# EAGLE design fusebox (EAGLE 9.5.2)

## Sheet 1 of 6: MC
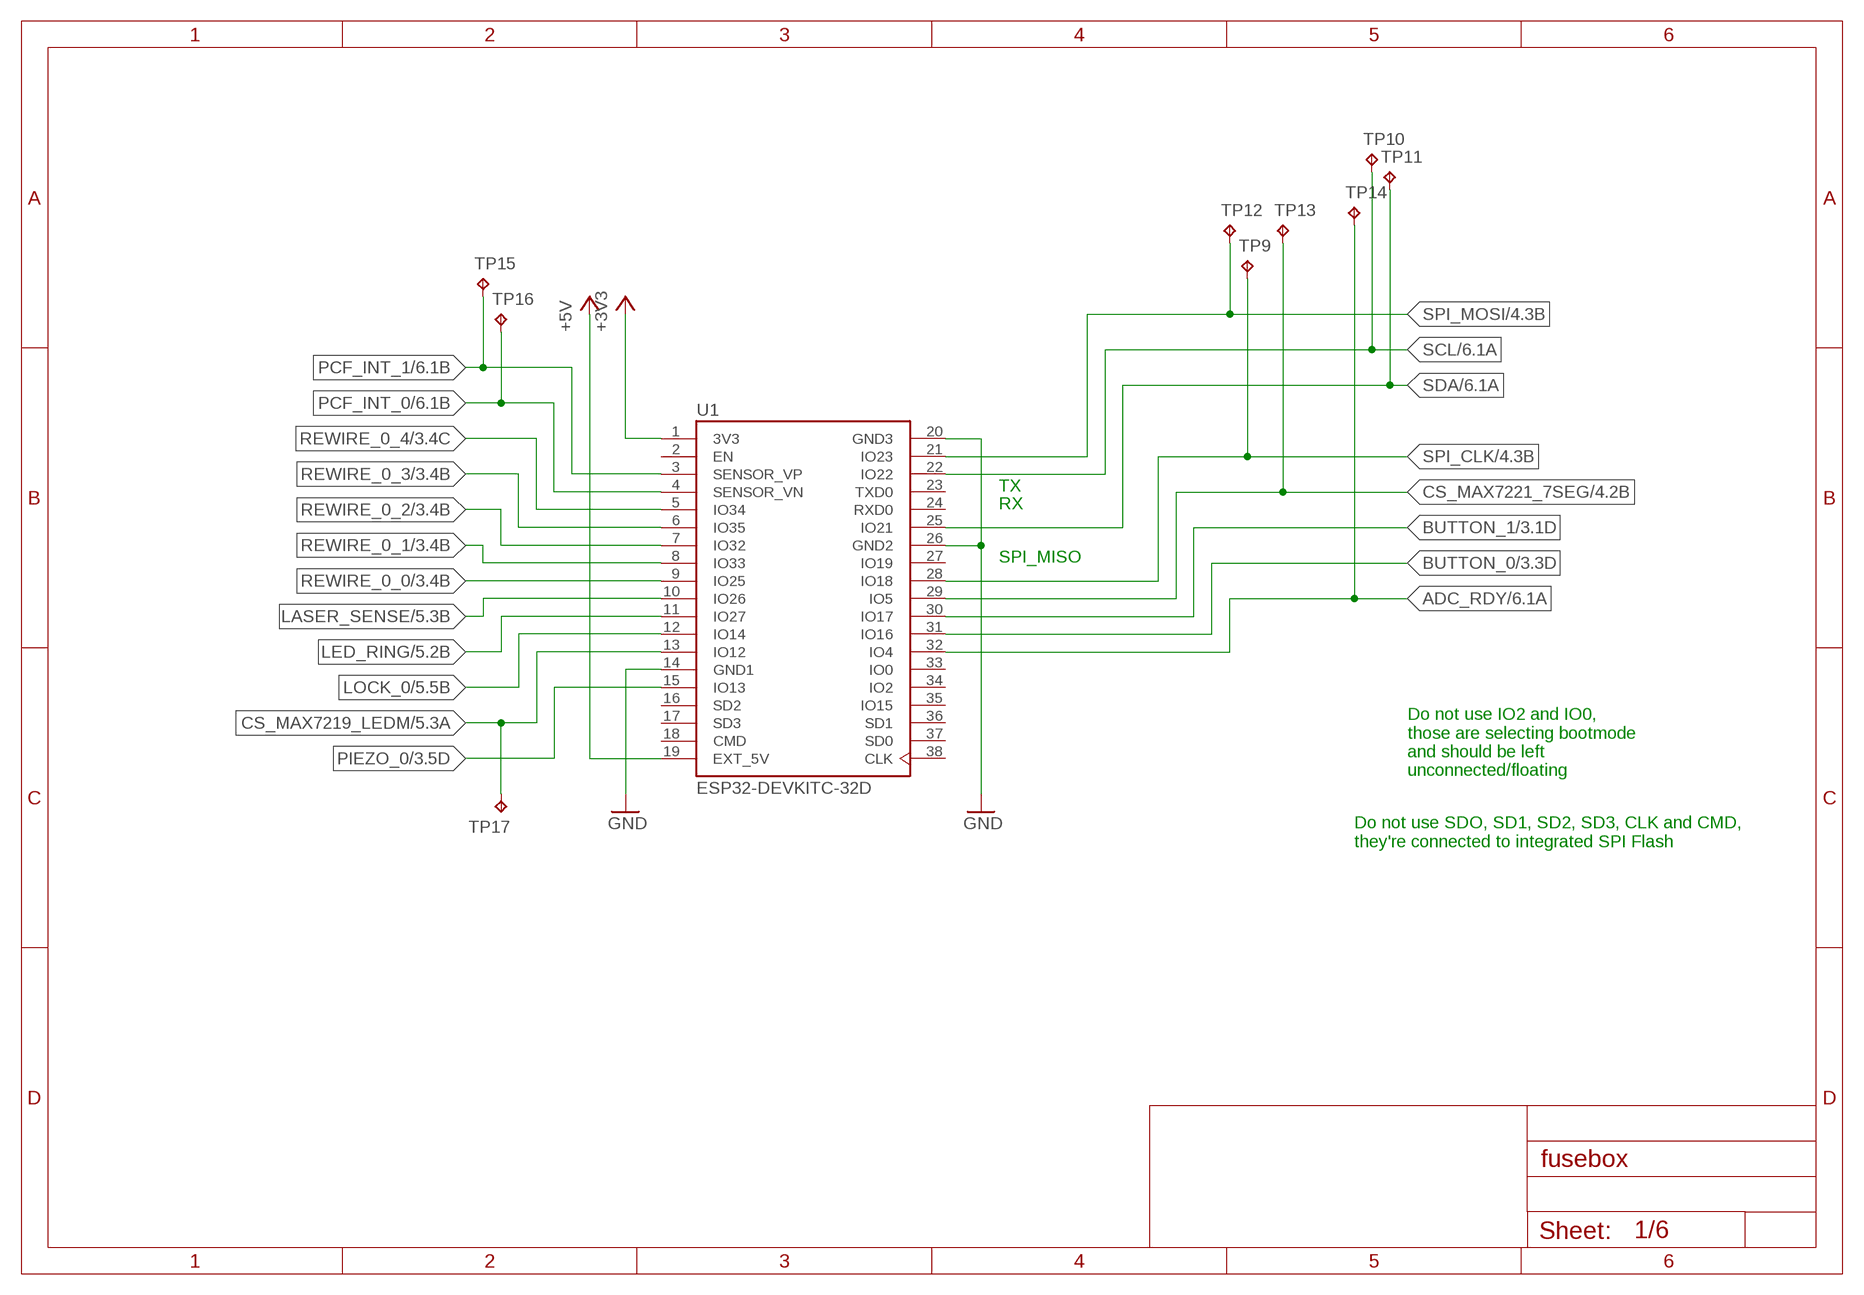
[diagram p0: schematic, sheet 1]

### Parts
TP9  TPB1,27  [B1,27]
TP10  TPB1,27  [B1,27]
TP11  TPB1,27  [B1,27]
TP12  TPB1,27  [B1,27]
TP13  TPB1,27  [B1,27]
TP14  TPB1,27  [B1,27]
TP15  TPB1,27  [B1,27]
TP16  TPB1,27  [B1,27]
TP17  TPB1,27  [B1,27]
U1  ESP32-DEVKITC-32D  [MODULE_ESP32-DEVKITC-32D]

### Nets
+3V3: U1.1(3V3) ; also sheet 3,5,6
+5V: U1.19(EXT_5V) ; also sheet 2,4,5
ADC_RDY: TP14.TP U1.32(IO4) ; also sheet 6
BUTTON_0: U1.31(IO16) ; also sheet 3
BUTTON_1: U1.30(IO17) ; also sheet 3
CS_MAX7219_LEDM: TP17.TP U1.13(IO12) ; also sheet 5
CS_MAX7221_7SEG: TP13.TP U1.29(IO5) ; also sheet 4
GND: U1.14(GND1) U1.20(GND3) U1.26(GND2) ; also sheet 2,3,4,5,6
LASER_SENSE: U1.10(IO26) ; also sheet 5
LED_RING: U1.11(IO27) ; also sheet 5
LOCK_0: U1.12(IO14) ; also sheet 5
PCF_INT_0: TP16.TP U1.4(SENSOR_VN) ; also sheet 6
PCF_INT_1: TP15.TP U1.3(SENSOR_VP) ; also sheet 6
PIEZO_0: U1.15(IO13) ; also sheet 3
REWIRE_0_0: U1.9(IO25) ; also sheet 3
REWIRE_0_1: U1.8(IO33) ; also sheet 3
REWIRE_0_2: U1.7(IO32) ; also sheet 3
REWIRE_0_3: U1.6(IO35) ; also sheet 3
REWIRE_0_4: U1.5(IO34) ; also sheet 3
SCL: TP10.TP U1.22(IO22) ; also sheet 6
SDA: TP11.TP U1.25(IO21) ; also sheet 6
SPI_CLK: TP9.TP U1.28(IO18) ; also sheet 4,5
SPI_MOSI: TP12.TP U1.21(IO23) ; also sheet 4,5
Unconnected: U1.2(EN) U1.16(SD2) U1.17(SD3) U1.18(CMD) U1.23(TXD0) U1.24(RXD0) U1.27(IO19) U1.33(IO0) U1.34(IO2) U1.35(IO15) U1.36(SD1) U1.37(SD0) U1.38(CLK)

### Notes on the sheet
- TX
- RX
- SPI_MISO
- Do not use IO2 and IO0, 
  those are selecting bootmode 
  and should be left 
  unconnected/floating
- Do not use SDO, SD1, SD2, SD3, CLK and CMD,
  they're connected to integrated SPI Flash

## Sheet 2 of 6: Power
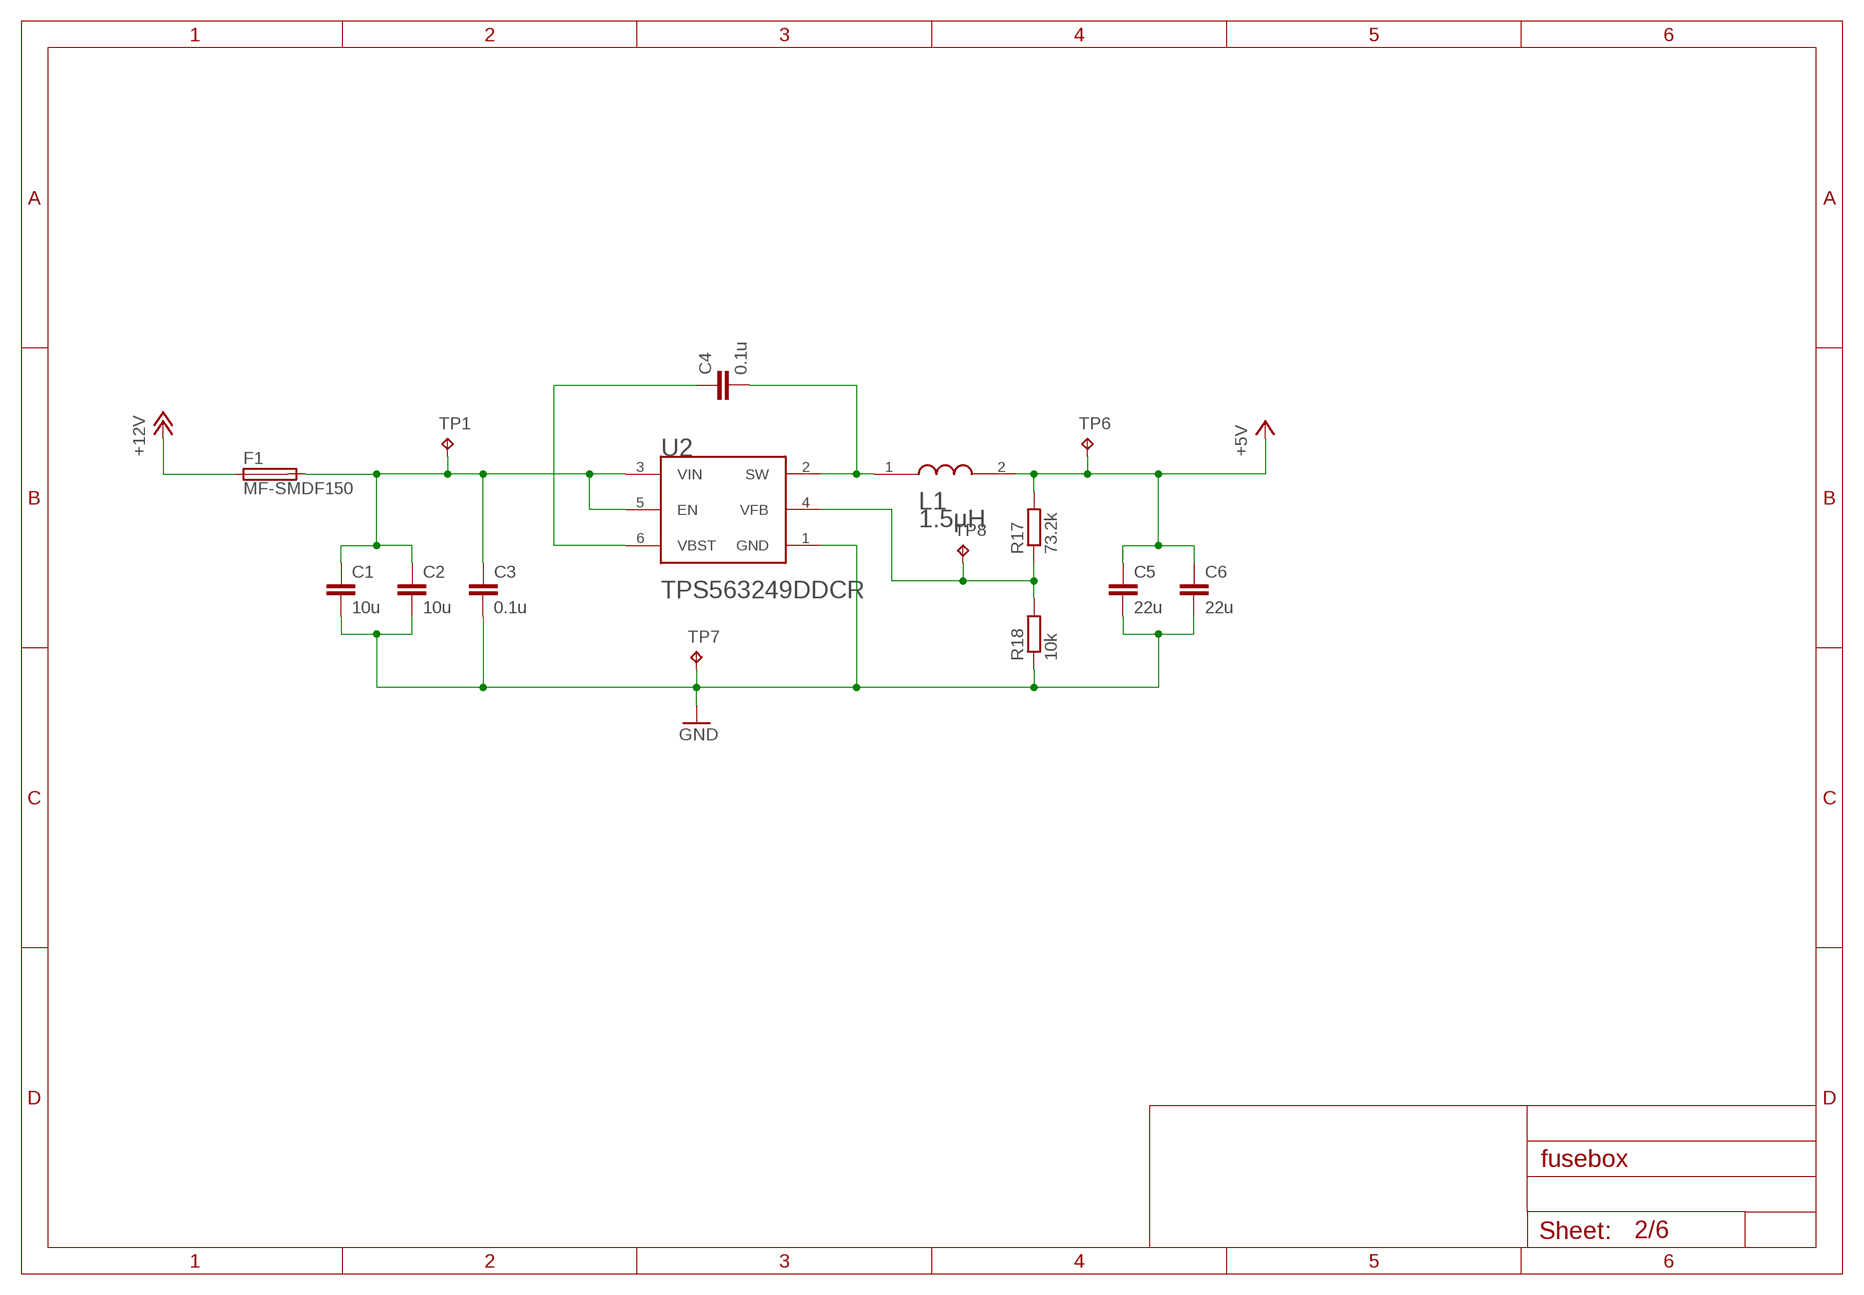
[diagram p1: schematic, sheet 2]

### Parts
C1  10u  C-EUC1206  [C1206]
C2  10u  C-EUC1206  [C1206]
C3  0.1u  C-EUC0603K  [C0603K]
C4  0.1u  C-EUC0603  [C0603]
C5  22u  C-EUC0603  [C0603]
C6  22u  C-EUC0603  [C0603]
F1  MF-SMDF150  [MF-SMDF050]
L1  BOURNS_SRN8040-1R5YBOURNS_SRN8040-1R5Y_0_0  [BOURNS_SRN8040-1R5Y_0]
R17  73.2k  R-EU_R0402  [R0402]
R18  10k  R-EU_R0201  [R0201]
TP1  TPB1,27  [B1,27]
TP6  TPB1,27  [B1,27]
TP7  TPB1,27  [B1,27]
TP8  TPB1,27  [B1,27]
U2  TEXAS_INSTRUMENTS_TPS563249DDCRTEXAS_INSTRUMENTS_TPS563249DDCR_0_0  [TEXAS_INSTRUMENTS_TPS563249DDCR_0]

### Nets
+5V: C5.1 C6.1 L1.2 R17.2 TP6.TP ; also sheet 1,4,5
+12V: F1.1 ; also sheet 5
GND: C1.2 C2.2 C3.2 C5.2 C6.2 R18.1 TP7.TP U2.1(GND) ; also sheet 1,3,4,5,6
N$18: C1.1 C2.1 C3.1 F1.2 TP1.TP U2.3(VIN) U2.5(EN)
N$36: C4.1 U2.6(VBST)
N$37: C4.2 L1.1 U2.2(SW)
N$39: R17.1 R18.2 TP8.TP U2.4(VFB)

## Sheet 3 of 6: Mechanical
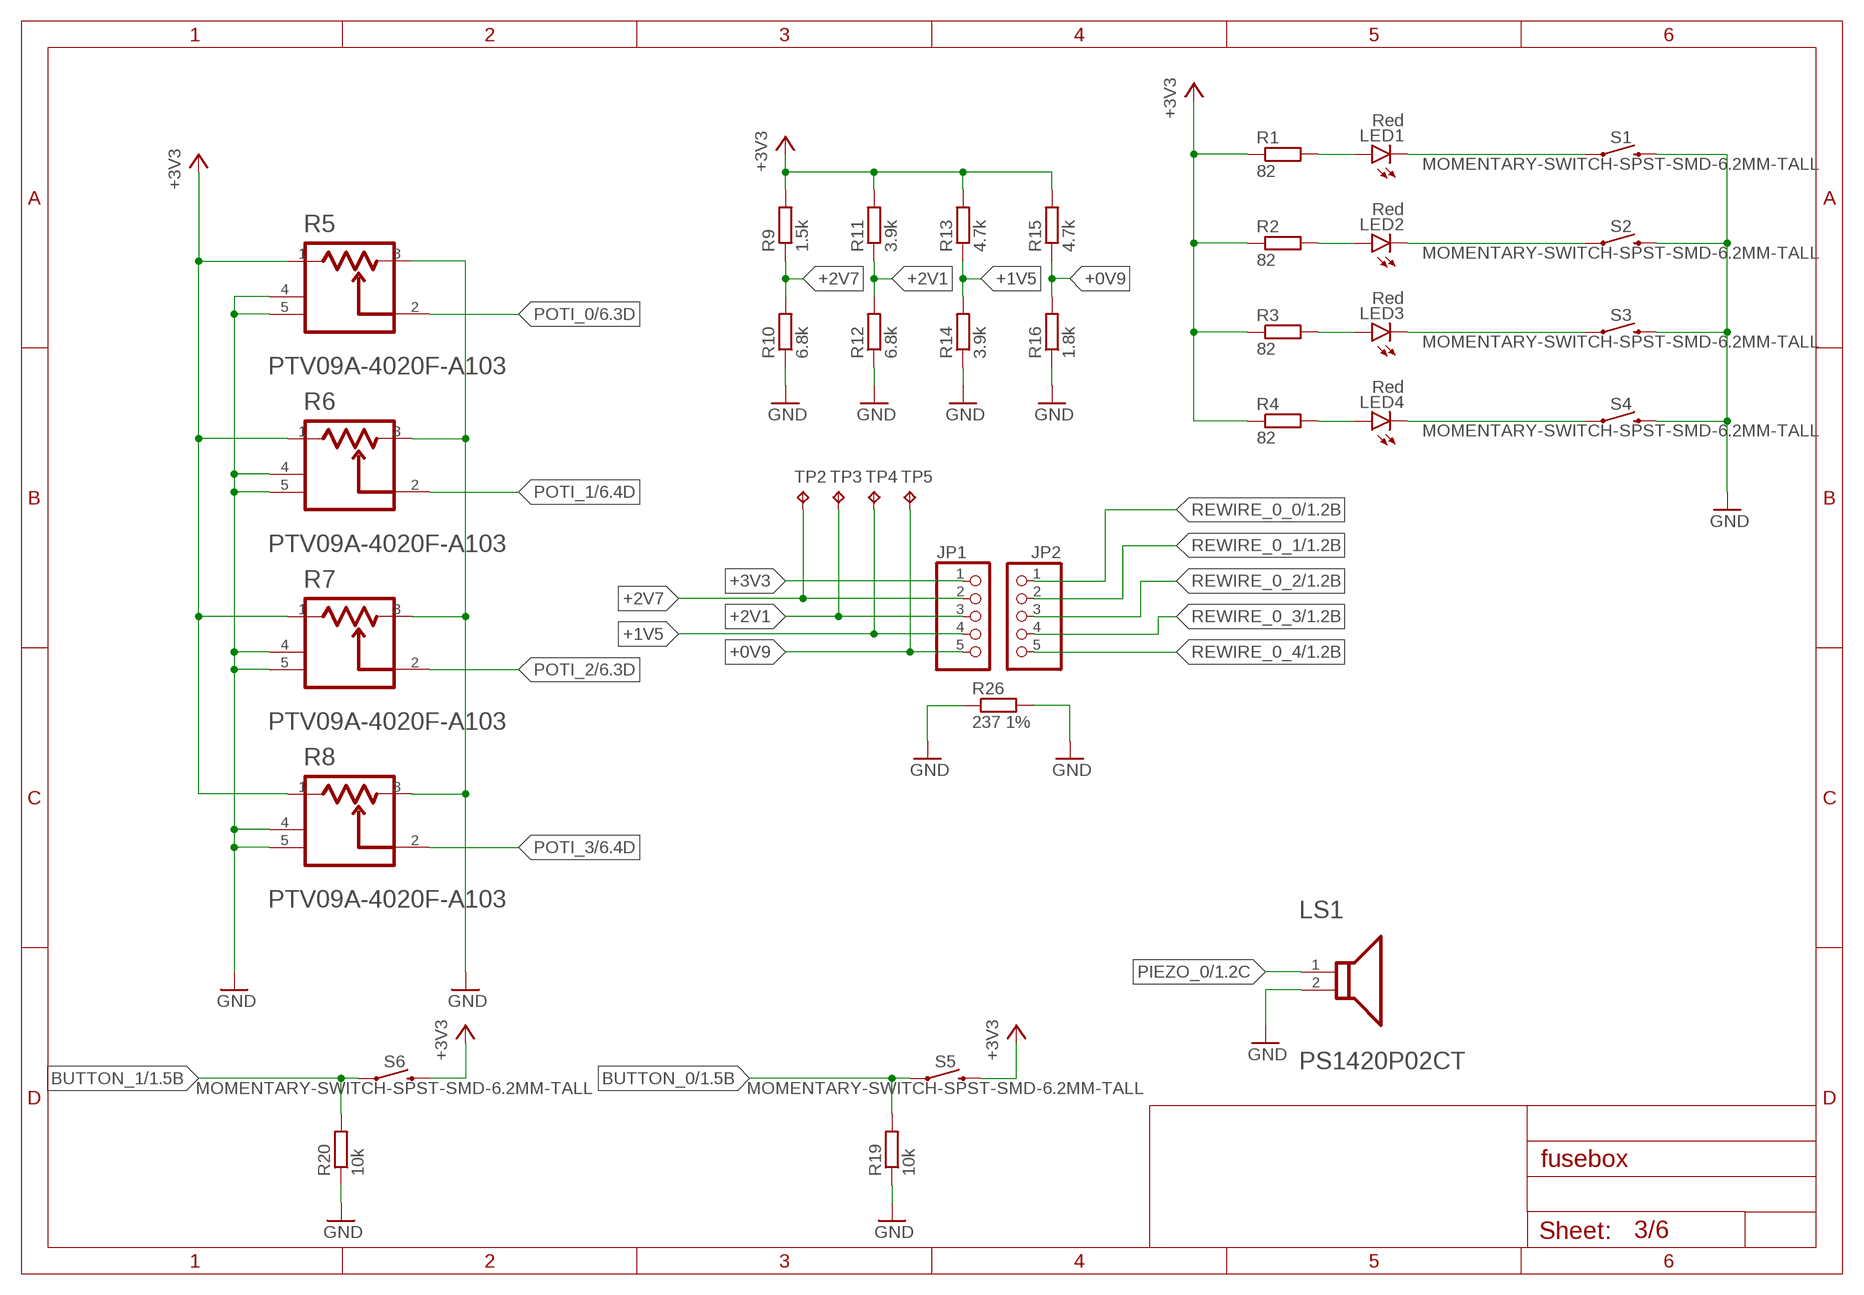
[diagram p2: schematic, sheet 3]

### Parts
JP1  PINHD-1X5  [1X05]
JP2  PINHD-1X5  [1X05]
LED1  Red  LEDCHIP-LED0805  [CHIP-LED0805]
LED2  Red  LEDCHIP-LED0805  [CHIP-LED0805]
LED3  Red  LEDCHIP-LED0805  [CHIP-LED0805]
LED4  Red  LEDCHIP-LED0805  [CHIP-LED0805]
LS1  TDK_PS1420P02CTTDK_PS1420P02CT_0_0  [TDK_PS1420P02CT_0]
R1  82  R-EU_R0805  [R0805]
R2  82  R-EU_R0805  [R0805]
R3  82  R-EU_R0805  [R0805]
R4  82  R-EU_R0805  [R0805]
R5  BOURNS_PTV09A-4020F-A103BOURNS_PTV09A-4020F-A103_0_0  [BOURNS_PTV09A-4020F-A103_0]
R6  BOURNS_PTV09A-4020F-A103BOURNS_PTV09A-4020F-A103_0_0  [BOURNS_PTV09A-4020F-A103_0]
R7  BOURNS_PTV09A-4020F-A103BOURNS_PTV09A-4020F-A103_0_0  [BOURNS_PTV09A-4020F-A103_0]
R8  BOURNS_PTV09A-4020F-A103BOURNS_PTV09A-4020F-A103_0_0  [BOURNS_PTV09A-4020F-A103_0]
R9  1.5k  R-EU_R0805  [R0805]
R10  6.8k  R-EU_R0805  [R0805]
R11  3.9k  R-EU_R0805  [R0805]
R12  6.8k  R-EU_R0805  [R0805]
R13  4.7k  R-EU_R0805  [R0805]
R14  3.9k  R-EU_R0805  [R0805]
R15  4.7k  R-EU_R0805  [R0805]
R16  1.8k  R-EU_R0805  [R0805]
R19  10k  R-EU_R0805  [R0805]
R20  10k  R-EU_R0805  [R0805]
R26  237 1%  R-EU_0411/15  [0411/15]
S1  MOMENTARY-SWITCH-SPST-SMD-6.2MM-TALL  [TACTILE_SWITCH_SMD_6.2MM_TALL]
S2  MOMENTARY-SWITCH-SPST-SMD-6.2MM-TALL  [TACTILE_SWITCH_SMD_6.2MM_TALL]
S3  MOMENTARY-SWITCH-SPST-SMD-6.2MM-TALL  [TACTILE_SWITCH_SMD_6.2MM_TALL]
S4  MOMENTARY-SWITCH-SPST-SMD-6.2MM-TALL  [TACTILE_SWITCH_SMD_6.2MM_TALL]
S5  MOMENTARY-SWITCH-SPST-SMD-6.2MM-TALL  [TACTILE_SWITCH_SMD_6.2MM_TALL]
S6  MOMENTARY-SWITCH-SPST-SMD-6.2MM-TALL  [TACTILE_SWITCH_SMD_6.2MM_TALL]
TP2  TPB1,27  [B1,27]
TP3  TPB1,27  [B1,27]
TP4  TPB1,27  [B1,27]
TP5  TPB1,27  [B1,27]

### Nets
+0V9: JP1.5 R15.1 R16.2 TP5.TP
+1V5: JP1.4 R13.1 R14.2 TP4.TP
+2V1: JP1.3 R11.1 R12.2 TP3.TP
+2V7: JP1.2 R9.1 R10.2 TP2.TP
+3V3: JP1.1 R1.1 R2.1 R3.1 R4.1 R5.1 R6.1 R7.1 R8.1 R9.2 R11.2 R13.2 R15.2 S5.B2 S6.B2 ; also sheet 1,5,6
BUTTON_0: R19.2 S5.A2 ; also sheet 1
BUTTON_1: R20.2 S6.A2 ; also sheet 1
GND: LS1.2 R5.3 R5.4(MNT_1) R5.5(MNT_2) R6.3 R6.4(MNT_1) R6.5(MNT_2) R7.3 R7.4(MNT_1) R7.5(MNT_2) R8.3 R8.4(MNT_1) R8.5(MNT_2) R10.1 R12.1 R14.1 R16.1 R19.1 R20.1 R26.1 R26.2 S1.B2 S2.B2 S3.B2 S4.B2 ; also sheet 1,2,4,5,6
N$1: LED1.A R1.2
N$2: LED2.A R2.2
N$3: LED3.A R3.2
N$4: LED4.A R4.2
N$5: LED1.C S1.A2
N$7: LED2.C S2.A2
N$9: LED3.C S3.A2
N$11: LED4.C S4.A2
PIEZO_0: LS1.1 ; also sheet 1
POTI_0: R5.2 ; also sheet 6
POTI_1: R6.2 ; also sheet 6
POTI_2: R7.2 ; also sheet 6
POTI_3: R8.2 ; also sheet 6
REWIRE_0_0: JP2.1 ; also sheet 1
REWIRE_0_1: JP2.2 ; also sheet 1
REWIRE_0_2: JP2.3 ; also sheet 1
REWIRE_0_3: JP2.4 ; also sheet 1
REWIRE_0_4: JP2.5 ; also sheet 1

## Sheet 4 of 6: 7 Segment
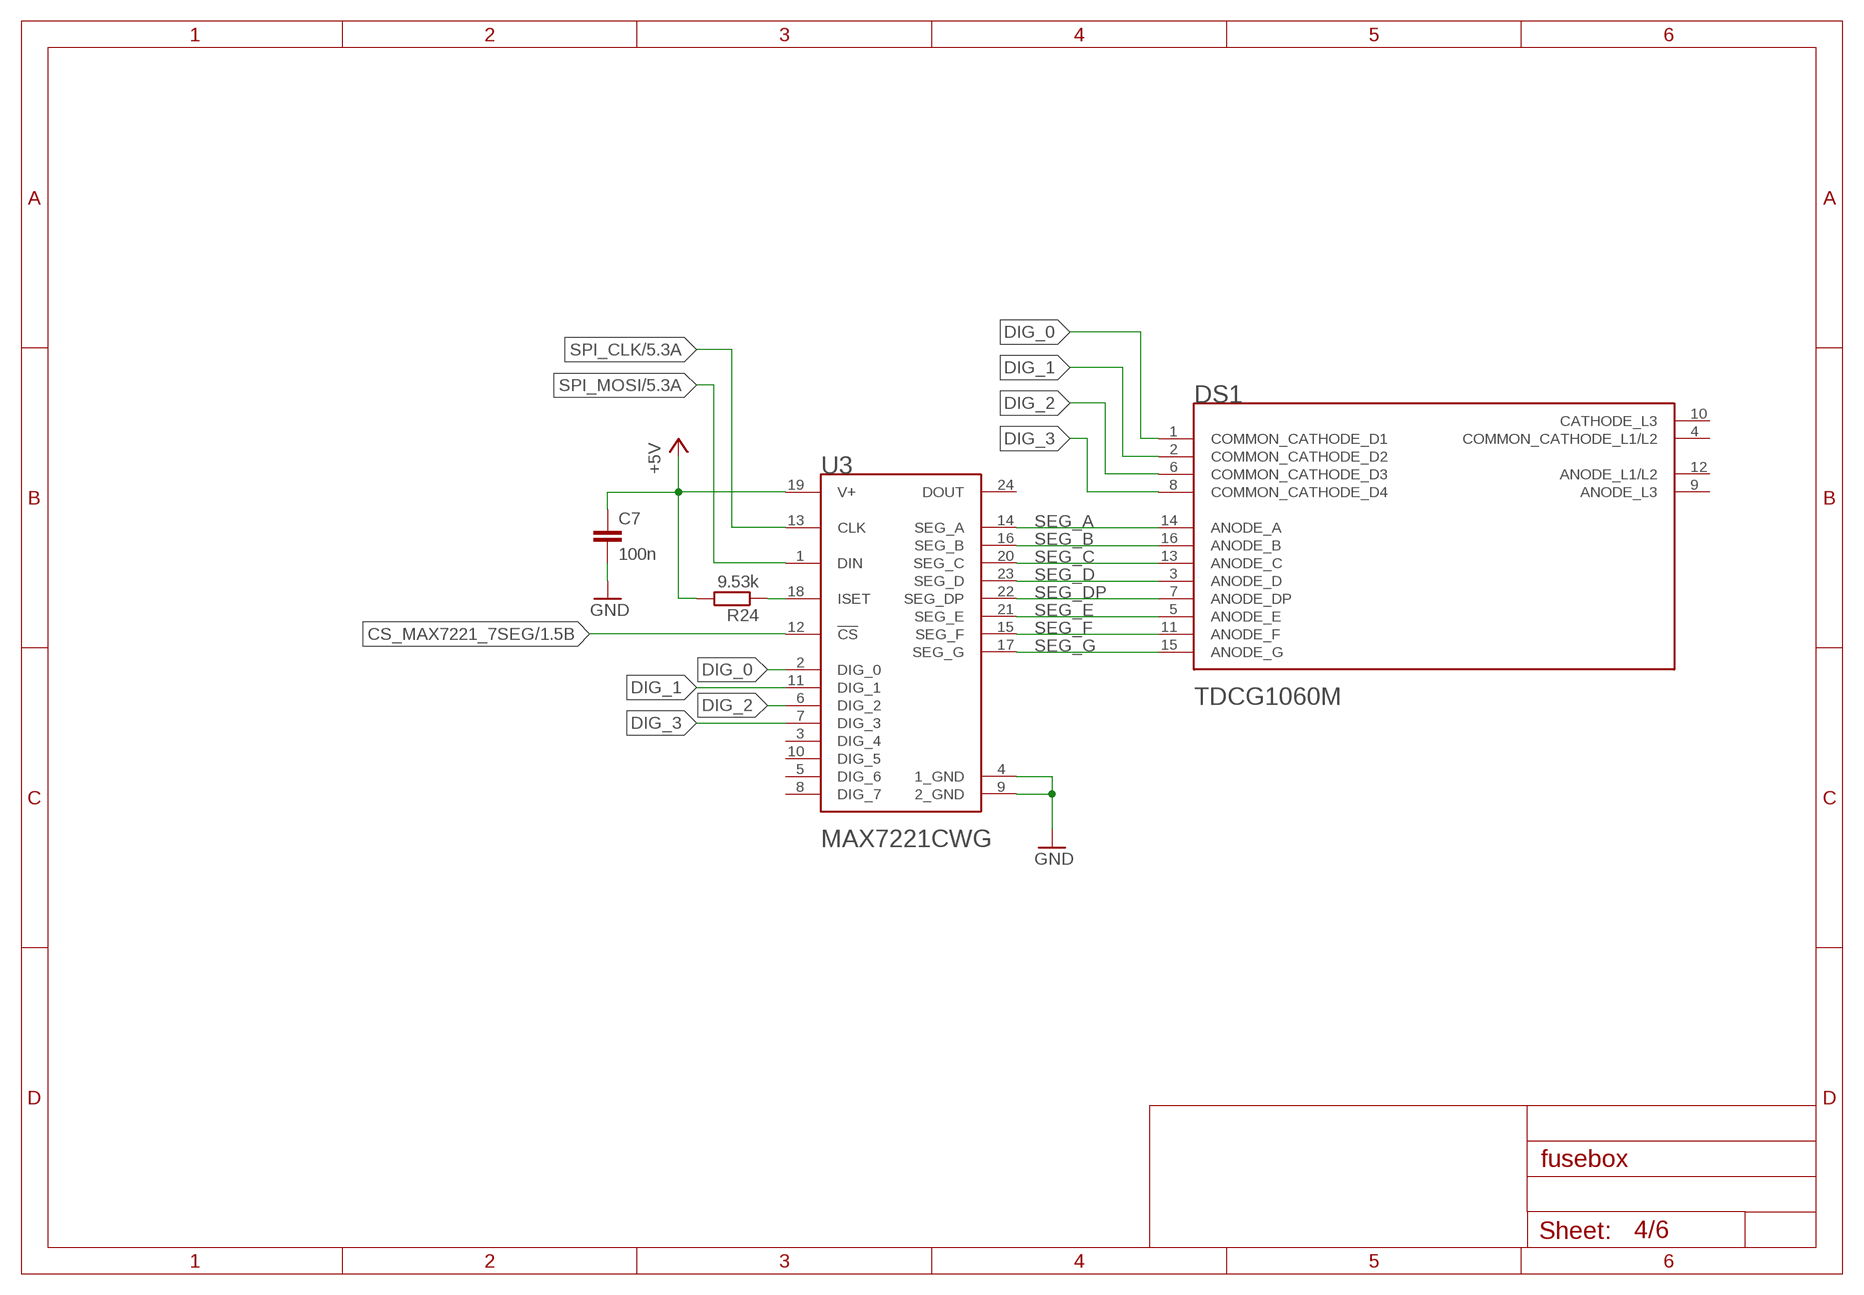
[diagram p3: schematic, sheet 4]

### Parts
C7  100n  C-EUC0805K  [C0805K]
DS1  VISHAY_TDCG1060MVISHAY_TDCG1060M_0_0  [VISHAY_TDCG1060M_0]
R24  9.53k  R-EU_R0805  [R0805]
U3  MAXIM_ELECTRONICS_MAX7221CWGMAXIM_ELECTRONICS_MAX7221CWG_0_0  [MAXIM_ELECTRONICS_MAX7221CWG_0]

### Nets
+5V: C7.1 R24.2 U3.19(V+) ; also sheet 1,2,5
CS_MAX7221_7SEG: U3.12(!CS!) ; also sheet 1
DIG_0: DS1.1(COMMON_CATHODE_D1) U3.2(DIG_0)
DIG_1: DS1.2(COMMON_CATHODE_D2) U3.11(DIG_1)
DIG_2: DS1.6(COMMON_CATHODE_D3) U3.6(DIG_2)
DIG_3: DS1.8(COMMON_CATHODE_D4) U3.7(DIG_3)
GND: C7.2 U3.4(1_GND) U3.9(2_GND) ; also sheet 1,2,3,5,6
N$23: R24.1 U3.18(ISET)
SEG_A: DS1.14(ANODE_A) U3.14(SEG_A)
SEG_B: DS1.16(ANODE_B) U3.16(SEG_B)
SEG_C: DS1.13(ANODE_C) U3.20(SEG_C)
SEG_D: DS1.3(ANODE_D) U3.23(SEG_D)
SEG_DP: DS1.7(ANODE_DP) U3.22(SEG_DP)
SEG_E: DS1.5(ANODE_E) U3.21(SEG_E)
SEG_F: DS1.11(ANODE_F) U3.15(SEG_F)
SEG_G: DS1.15(ANODE_G) U3.17(SEG_G)
SPI_CLK: U3.13(CLK) ; also sheet 1,5
SPI_MOSI: U3.1(DIN) ; also sheet 1,5
Unconnected: DS1.4(COMMON_CATHODE_L1/L2) DS1.9(ANODE_L3) DS1.10(CATHODE_L3) DS1.12(ANODE_L1/L2) U3.3(DIG_4) U3.5(DIG_6) U3.8(DIG_7) U3.10(DIG_5) U3.24(DOUT)

## Sheet 5 of 6: Connections
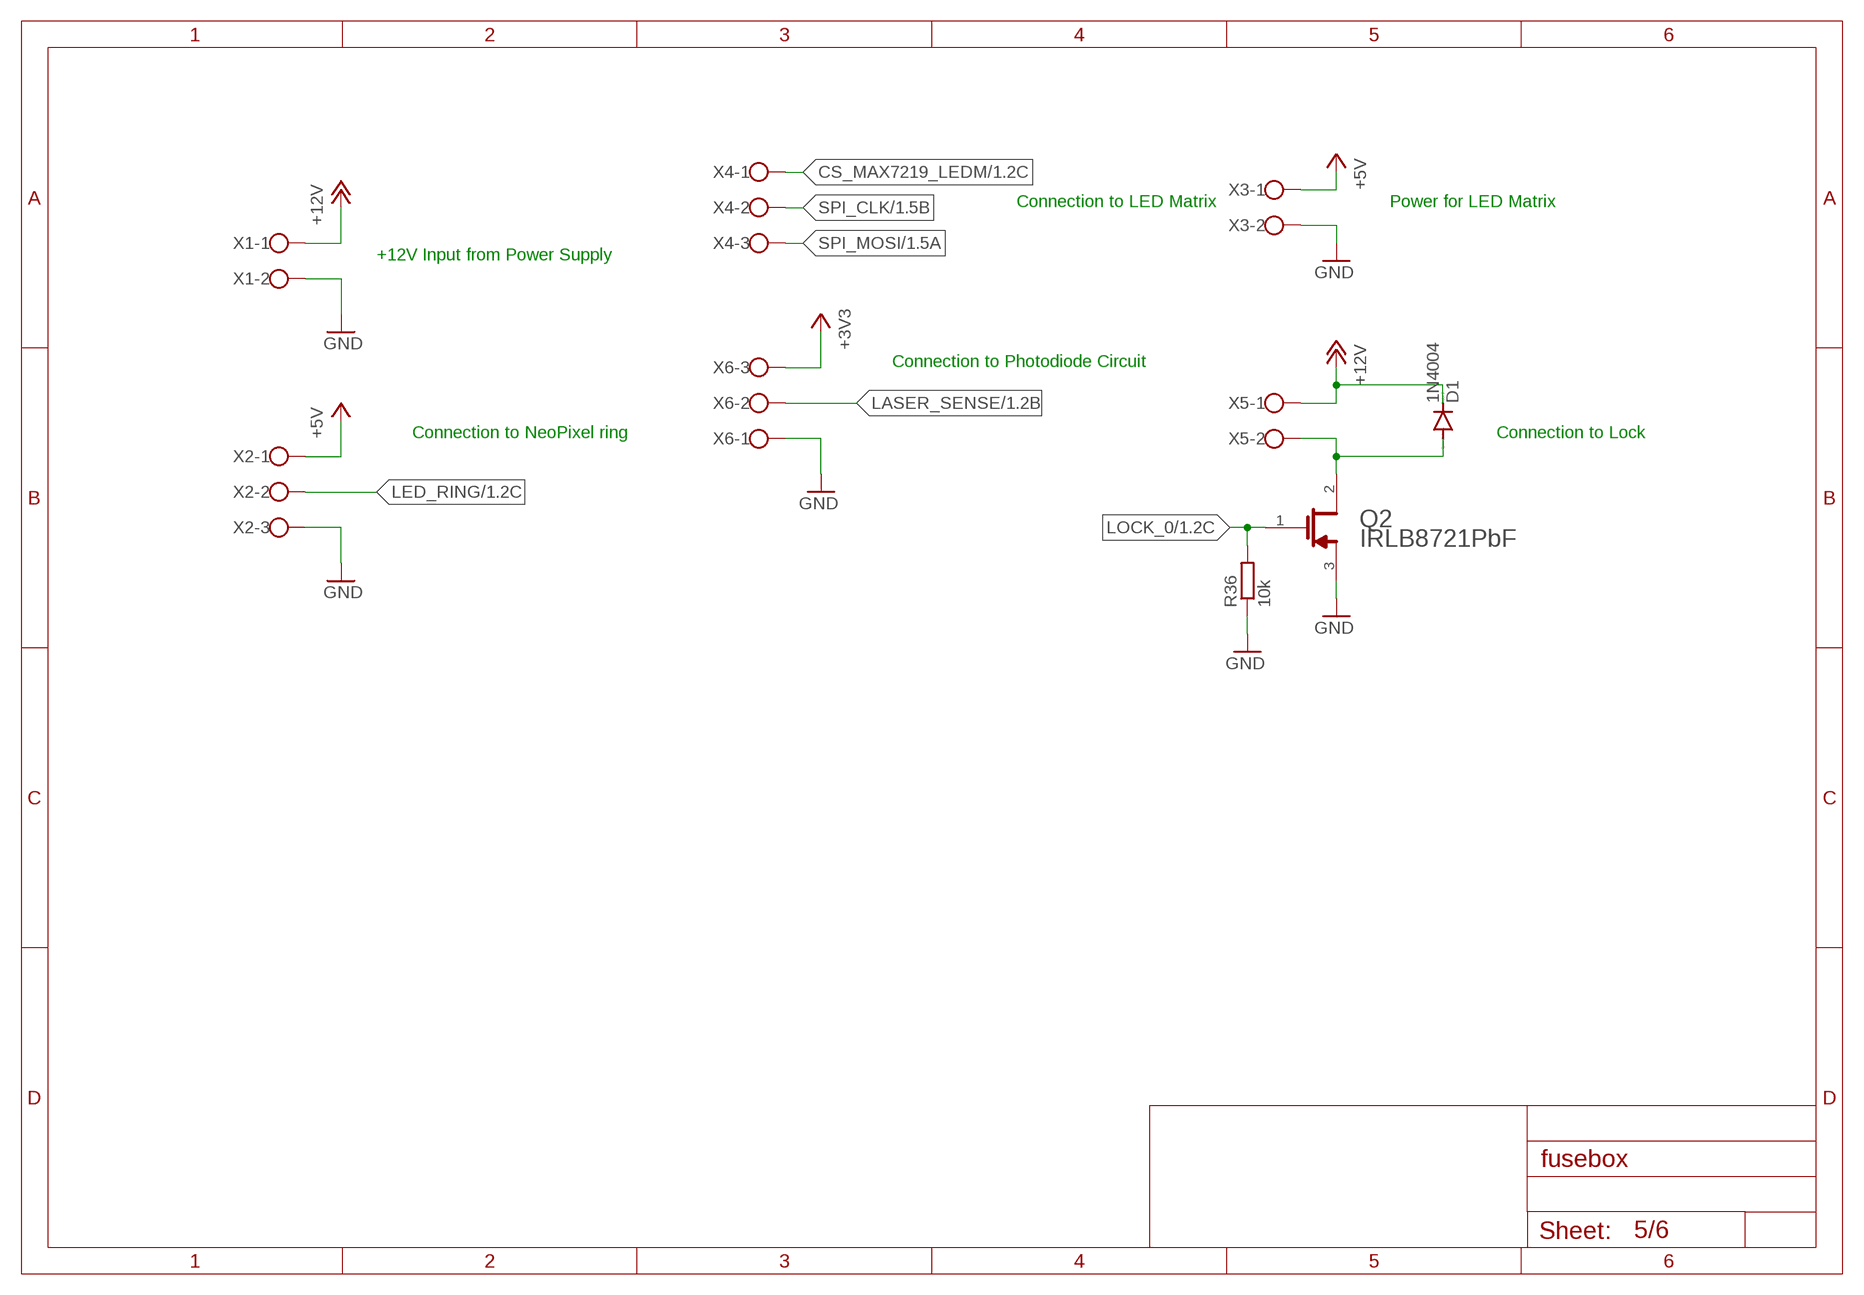
[diagram p4: schematic, sheet 5]

### Parts
D1  1N4004  [DO41-10]
Q2  INFINEON_IRLB8721PBFINFINEON_IRLB8721PBF_0_0  [INFINEON_IRLB8721PBF_0]
R36  10k  R-EU_R0805  [R0805]
X1  W237-102  [W237-102]
X2  W237-103  [W237-103]
X3  W237-102  [W237-102]
X4  W237-103  [W237-103]
X5  W237-102  [W237-102]
X6  W237-103  [W237-103]

### Nets
+3V3: X6.3 ; also sheet 1,3,6
+5V: X2.1 X3.1 ; also sheet 1,2,4
+12V: D1.C X1.1 X5.1 ; also sheet 2
CS_MAX7219_LEDM: X4.1 ; also sheet 1
GND: Q2.3(S) R36.1 X1.2 X2.3 X3.2 X6.1 ; also sheet 1,2,3,4,6
LASER_SENSE: X6.2 ; also sheet 1
LED_RING: X2.2 ; also sheet 1
LOCK_0: Q2.1(G) R36.2 ; also sheet 1
N$25: D1.A Q2.2(D) X5.2
SPI_CLK: X4.2 ; also sheet 1,4
SPI_MOSI: X4.3 ; also sheet 1,4

### Notes on the sheet
- Connection to LED Matrix | Power for LED Matrix
- +12V Input from Power Supply
- Connection to Photodiode Circuit
- Connection to NeoPixel ring | Connection to Lock

## Sheet 6 of 6: I2C
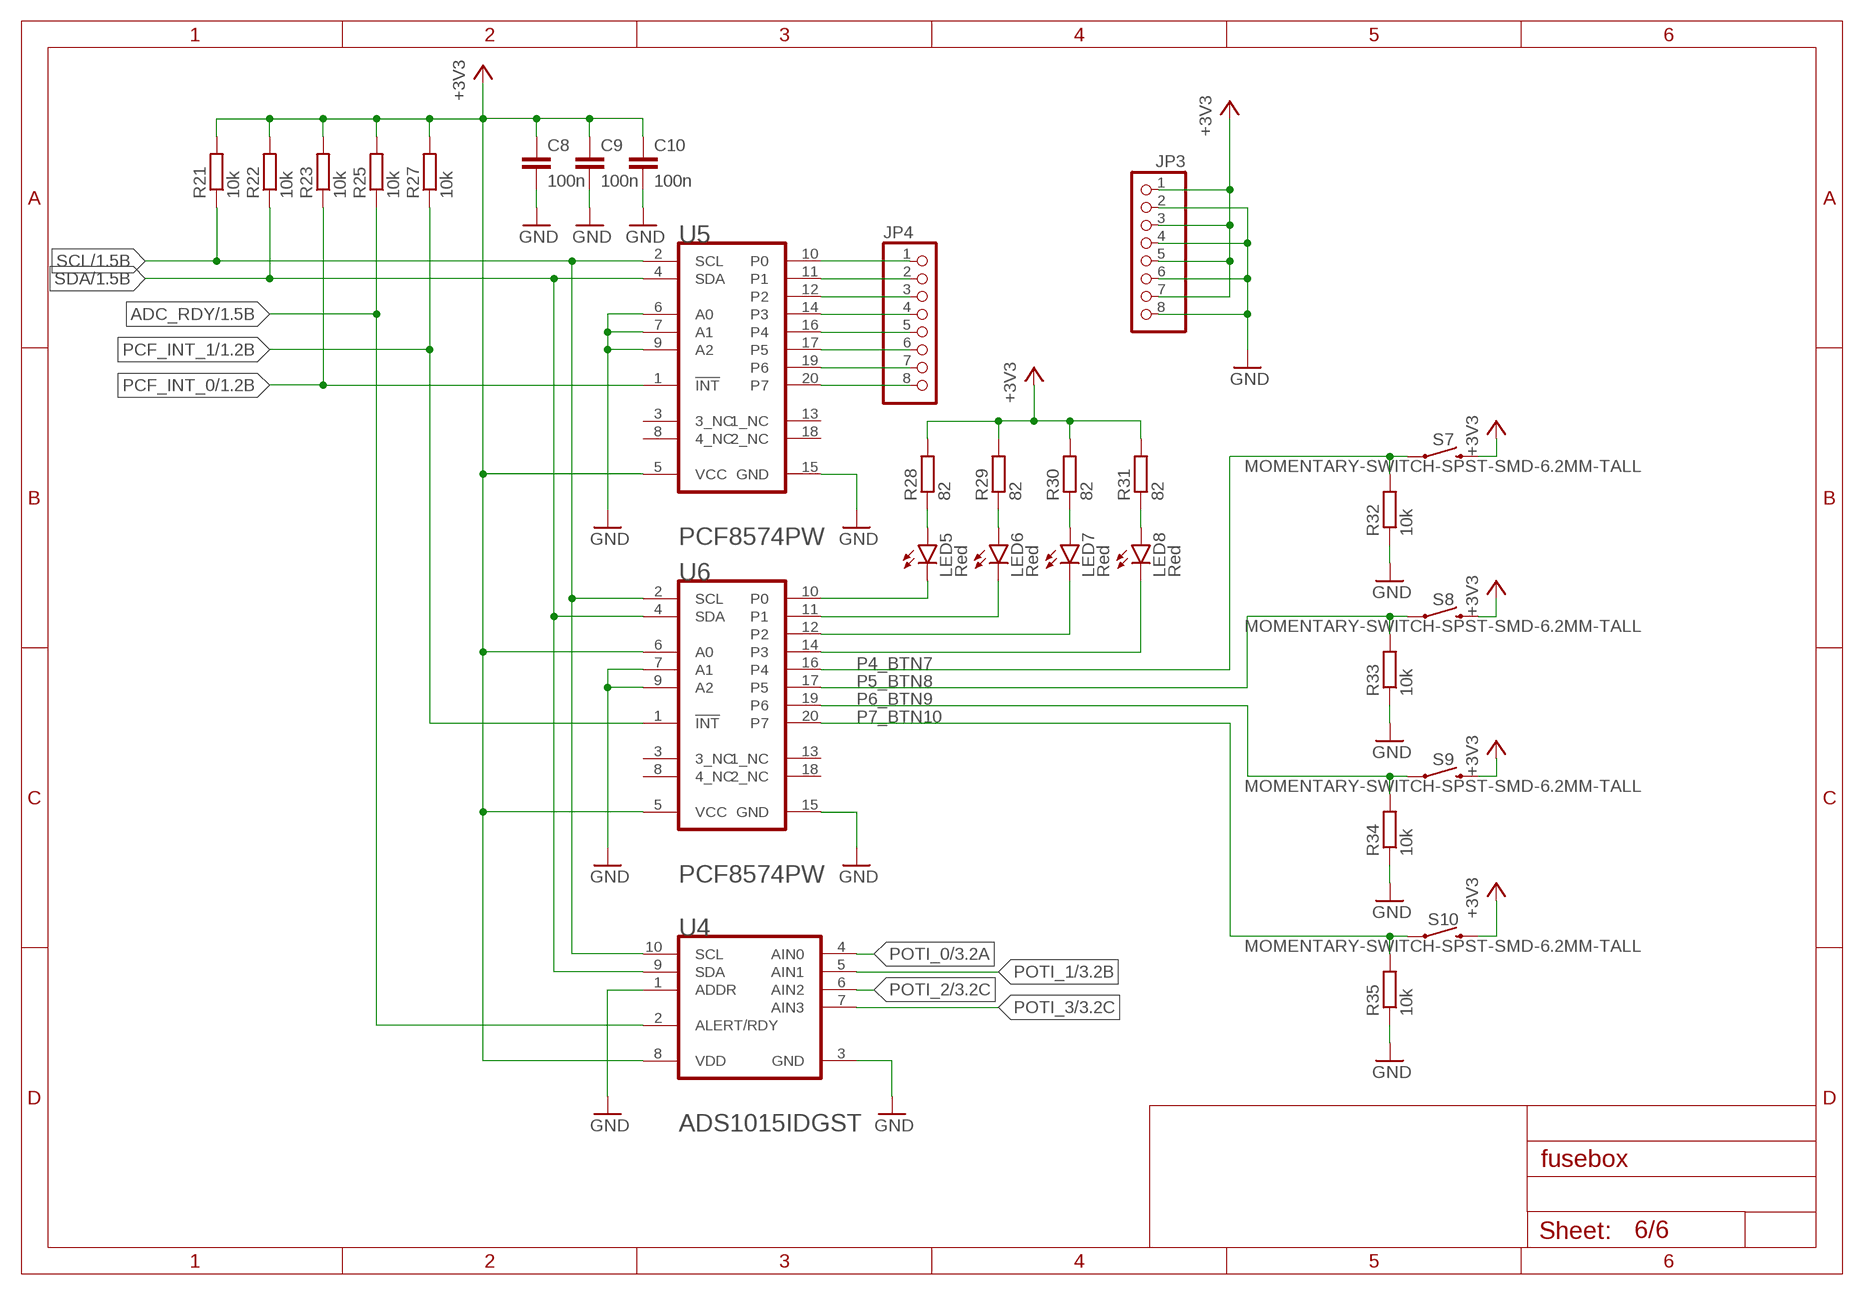
[diagram p5: schematic, sheet 6]

### Parts
C8  100n  C-EUC0805K  [C0805K]
C9  100n  C-EUC0805K  [C0805K]
C10  100n  C-EUC0805K  [C0805K]
JP3  PINHD-1X8  [1X08]
JP4  PINHD-1X8  [1X08]
LED5  Red  LEDCHIP-LED0805  [CHIP-LED0805]
LED6  Red  LEDCHIP-LED0805  [CHIP-LED0805]
LED7  Red  LEDCHIP-LED0805  [CHIP-LED0805]
LED8  Red  LEDCHIP-LED0805  [CHIP-LED0805]
R21  10k  R-EU_R0805  [R0805]
R22  10k  R-EU_R0805  [R0805]
R23  10k  R-EU_R0805  [R0805]
R25  10k  R-EU_R0805  [R0805]
R27  10k  R-EU_R0805  [R0805]
R28  82  R-EU_R0805  [R0805]
R29  82  R-EU_R0805  [R0805]
R30  82  R-EU_R0805  [R0805]
R31  82  R-EU_R0805  [R0805]
R32  10k  R-EU_R0805  [R0805]
R33  10k  R-EU_R0805  [R0805]
R34  10k  R-EU_R0805  [R0805]
R35  10k  R-EU_R0805  [R0805]
S7  MOMENTARY-SWITCH-SPST-SMD-6.2MM-TALL  [TACTILE_SWITCH_SMD_6.2MM_TALL]
S8  MOMENTARY-SWITCH-SPST-SMD-6.2MM-TALL  [TACTILE_SWITCH_SMD_6.2MM_TALL]
S9  MOMENTARY-SWITCH-SPST-SMD-6.2MM-TALL  [TACTILE_SWITCH_SMD_6.2MM_TALL]
S10  MOMENTARY-SWITCH-SPST-SMD-6.2MM-TALL  [TACTILE_SWITCH_SMD_6.2MM_TALL]
U4  TEXAS_INSTRUMENTS_ADS1015IDGSTTEXAS_INSTRUMENTS_ADS1015IDGST_0_0  [TEXAS_INSTRUMENTS_ADS1015IDGST_0]
U5  TEXAS_INSTRUMENTS_PCF8574PWTEXAS_INSTRUMENTS_PCF8574PW_0_0  [TEXAS_INSTRUMENTS_PCF8574PW_0]
U6  TEXAS_INSTRUMENTS_PCF8574PWTEXAS_INSTRUMENTS_PCF8574PW_0_0  [TEXAS_INSTRUMENTS_PCF8574PW_0]

### Nets
+3V3: C8.1 C9.1 C10.1 JP3.1 JP3.3 JP3.5 JP3.7 R21.2 R22.2 R23.2 R25.2 R27.2 R28.2 R29.2 R30.2 R31.2 S7.B2 S8.B2 S9.B2 S10.B2 U4.8(VDD) U5.5(VCC) U6.5(VCC) U6.6(A0) ; also sheet 1,3,5
ADC_RDY: R25.1 U4.2(ALERT/RDY) ; also sheet 1
GND: C8.2 C9.2 C10.2 JP3.2 JP3.4 JP3.6 JP3.8 R32.1 R33.1 R34.1 R35.1 U4.1(ADDR) U4.3(GND) U5.6(A0) U5.7(A1) U5.9(A2) U5.15(GND) U6.7(A1) U6.9(A2) U6.15(GND) ; also sheet 1,2,3,4,5
N$17: LED5.A R28.1
N$19: LED5.C U6.10(P0)
N$20: LED6.A R29.1
N$21: LED6.C U6.11(P1)
N$22: LED7.A R30.1
N$24: LED7.C U6.12(P2)
N$26: JP4.1 U5.10(P0)
N$27: JP4.2 U5.11(P1)
N$28: JP4.3 U5.12(P2)
N$29: JP4.4 U5.14(P3)
N$30: JP4.5 U5.16(P4)
N$31: JP4.6 U5.17(P5)
N$32: JP4.7 U5.19(P6)
N$33: JP4.8 U5.20(P7)
N$34: LED8.A R31.1
N$35: LED8.C U6.14(P3)
P4_BTN7: R32.2 S7.A2 U6.16(P4)
P5_BTN8: R33.2 S8.A2 U6.17(P5)
P6_BTN9: R34.2 S9.A2 U6.19(P6)
P7_BTN10: R35.2 S10.A2 U6.20(P7)
PCF_INT_0: R23.1 U5.1(!INT!) ; also sheet 1
PCF_INT_1: R27.1 U6.1(!INT!) ; also sheet 1
POTI_0: U4.4(AIN0) ; also sheet 3
POTI_1: U4.5(AIN1) ; also sheet 3
POTI_2: U4.6(AIN2) ; also sheet 3
POTI_3: U4.7(AIN3) ; also sheet 3
SCL: R21.1 U4.10(SCL) U5.2(SCL) U6.2(SCL) ; also sheet 1
SDA: R22.1 U4.9(SDA) U5.4(SDA) U6.4(SDA) ; also sheet 1
Unconnected: U5.3(3_NC) U5.8(4_NC) U5.13(1_NC) U5.18(2_NC) U6.3(3_NC) U6.8(4_NC) U6.13(1_NC) U6.18(2_NC)

## Library data of the parts
C1-C10 = rcl:C-EU: CAPACITOR, European symbol; SPICEPREFIX: C
D1 = diode:1N4004: DIODE general purpose rectifier, 1 A
DS1 = Vishay - TDCG1060M:VISHAY_TDCG1060M: DISPLAY, SEVEN SEGMENT, 10MM, GREEN; CENTROID_NOT_SPECIFIED: No; DATASHEET: http://www.vishay.com/docs/83180/tdc10m.pdf; DIGIKEY_DESCRIPTION: DISP CLOCKMODULE 10MM GREEN M.PLEX C.; DIGIKEY_PART_NUMBER: TDCG1060M-ND; LEAD_FREE: yes; MF: Vishay; MFG_PACKAGE_IDENT: TDCG1060M; MFG_PACKAGE_IDENT_DATE: 0; MFG_PACKAGE_IDENT_REV: 0; MOUSER_DESCRIPTION: LED Displays & Accessories 4-Dig Grn 2.8-4.0mcd Common Cathode; MOUSER_PART_NUMBER: 78-TDCG1060; MPN: TDCG1060M; PACKAGE: THD_40MM45_13MM05; PREFIX: DS; ROHS: yes; TEMPERATURE_RANGE_HIGH: +85°C; TEMPERATURE_RANGE_LOW: -40°C
F1 = fuse:MF-SMDF: MF-SMDF Series - PRC Resettable Fuses Source: http://www.farnell.com/datasheets/716597.pdf
JP1 JP2 = pinhead:PINHD-1X5: PIN HEADER
JP3 JP4 = pinhead:PINHD-1X8: PIN HEADER
L1 = Bourns - SRN8040-1R5Y:BOURNS_SRN8040-1R5Y: Semi-shielded Power Inductors; CENTROID_NOT_SPECIFIED: No; CURRENT_RATING: 7A; DATASHEET: https://www.bourns.com/data/global/pdfs/SRN8040.pdf; DC_RESISTANCE_(DCR): 11 mOhm Max; DIGIKEY_DESCRIPTION: IND FIXED IND 1.5UH 7A 11 MOHM SMD; DIGIKEY_PART_NUMBER: SRN8040-1R5YCT-ND; INDUCTANCE: 1.5µH; LEAD_FREE: yes; MF: Bourns; MOUSER_PART_NUMBER: 652-SRN8040-1R5Y; MPN: SRN8040-1R5Y; PACKAGE: IND_SMD_8MM0_8MM0; PREFIX: L; ROHS: yes; TEMPERATURE_RANGE_HIGH: +125°C; TEMPERATURE_RANGE_LOW: -40°C; TOLERANCE: ±30%
LED1-LED8 = led:LED: LED OSRAM: - CHIPLED LG R971, LG N971, LY N971, LG Q971, LY Q971, LO R971, LY R971 LH N974, LH R974 LS Q976, LO Q976, LY Q976 LO Q996 - Hyper CHIPLED LW Q18S LB Q993, LB Q99A, LB R99A - SideLED LS A670, LO A670, LY A670, LG A670, LP A670 LB A673, LV A673, LT A673, LW A673 LH A674 LY A675 LS A676, LA A676, LO A676, LY A676, LW A676 LS A679, LY A679, LG A679 - Hyper Micro SIDELED® LS Y876, LA Y876, LO Y876, LY Y876 LT Y87S - SmartLED LW L88C, LW L88S LB L89C, LB L89S, LG L890 LS L89K, LO L89K, LY L89K LS L896, LA L896, LO L896, LY L896 - TOPLED LS T670, LO T670, LY T670, LG T670, LP T670 LSG T670, LSP T670, LSY T670, LOP T670, LYG T670 LG T671, LOG T671, LSG T671 LB T673, LV T673, LT T673, LW T673 LH T674 LS T676, LA T676, LO T676, LY T676, LB T676, LH T676, LSB T676, LW T676 LB T67C, LV T67C, LT T67C, LS T67K, LO T67K, LY T67K, LW E67C LS E67B, LA E67B, LO E67B, LY E67B, LB E67C, LV E67C, LT E67C LW T67C LS T679, LY T679, LG T679 LS T770, LO T770, LY T770, LG T770, LP T770 LB T773, LV T773, LT T773, LW T773 LH T774 LS E675, LA E675, LY E675, LS T675 LS T776, LA T776, LO T776, LY T776, LB T776 LHGB T686 LT T68C, LB T68C - Hyper Mini TOPLED® LB M676 - Mini TOPLED Santana® LG M470 LS M47K, LO M47K, LY M47K Source: http://www.osram.convergy.de LUXEON: - LUMILED® LXK2-PW12-R00, LXK2-PW12-S00, LXK2-PW14-U00, LXK2-PW14-V00 LXK2-PM12-R00, LXK2-PM12-S00, LXK2-PM14-U00 LXK2-PE12-Q00, LXK2-PE12-R00, LXK2-PE12-S00, LXK2-PE14-T00, LXK2-PE14-U00 LXK2-PB12-K00, LXK2-PB12-L00, LXK2-PB12-M00, LXK2-PB14-N00, LXK2-PB14-P00, LXK2-PB14-Q00 LXK2-PR12-L00, LXK2-PR12-M00, LXK2-PR14-Q00, LXK2-PR14-R00 LXK2-PD12-Q00, LXK2-PD12-R00, LXK2-PD12-S00 LXK2-PH12-R00, LXK2-PH12-S00 LXK2-PL12-P00, LXK2-PL12-Q00, LXK2-PL12-R00 Source: www.luxeon.com KINGBRIGHT: KA-3528ASYC Source: www.kingbright.com
LS1 = TDK - PS1420P02CT:TDK_PS1420P02CT: Piezoelectric Buzzers; CENTROID_NOT_SPECIFIED: No; DATASHEET: https://upverter.com/datasheet/458958daf548c3d54cf9a7d1ea1ff395e223655a.pdf; DIGIKEY_DESCRIPTION: SPEAK AUDIO PIEZO TRANSDUCER 30V TH; DIGIKEY_PART_NUMBER: 445-2526-1-ND; IPC_LAND_PATTERN_NAME: CAPRD500W80D1400H1100; LEAD_FREE: yes; MF: TDK; MOUSER_PART_NUMBER: 810-PS1420P02CT; MPN: PS1420P02CT; PACKAGE: PTH_BZ; PREFIX: LS; ROHS: yes; TEMPERATURE_RANGE_HIGH: +70°C; TEMPERATURE_RANGE_LOW: -10°C
Q2 = Infineon - IRLB8721PbF:INFINEON_IRLB8721PBF: High Frequency Synchronous Buck Converter; CENTROID_NOT_SPECIFIED: No; DATASHEET: https://upverter.com/datasheet/6023de1dc29e00ae136963535d37ebb95ee78d8c.pdf; DIGIKEY_DESCRIPTION: TRANS MOSFET N-CH 30V 62A TO-220AB; DIGIKEY_PART_NUMBER: IRLB8721PBF-ND; IMPORTED_FROM: octopart; IPC_LAND_PATTERN_NAME: TO-220; LEAD_FREE: yes; MF: Infineon; MOUNTING_TYPE: through hole; MOUSER_PART_NUMBER: 942-IRLB8721PBF; MPN: IRLB8721PbF; NUM_PINS: 3; PACKAGE: TO220AB-3; PREFIX: Q; ROHS: yes; SYMBOL_0_0: N-Channel Enhanced MOSFET; TEMPERATURE_RANGE_HIGH: +175°C; TEMPERATURE_RANGE_LOW: -55°C; TYPE: transistor
R1-R4 R9-R36 = rcl:R-EU_: RESISTOR, European symbol; SPICEPREFIX: R
R5-R8 = Bourns - PTV09A-4020F-A103:BOURNS_PTV09A-4020F-A103: PTV09 series 9mm Potentiometer; CENTROID_NOT_SPECIFIED: No; DATASHEET: http://www.bourns.com/data/global/pdfs/PTV09.pdf; DIGIKEY_DESCRIPTION: RES POT 10K OHM 1/20W CARBON LOG; DIGIKEY_PART_NUMBER: PTV09A-4020F-A103-ND; LEAD_FREE: yes; MF: Bourns; MFG_PACKAGE_IDENT: PTV09A-4; MOUSER_PART_NUMBER: 652-PTV09A-4020FA103; MPN: PTV09A-4020F-A103; PACKAGE: POT_PTH_9MMO; POWER: 50mW; PREFIX: VR; RESISTANCE: 10k; ROHS: yes; TEMPERATURE_RANGE_HIGH: +50°C; TEMPERATURE_RANGE_LOW: -10°C
S1-S10 = SparkFun-Switches:MOMENTARY-SWITCH-SPST: Momentary Switch (Pushbutton) - SPST Normally-open (NO) SPST momentary switches (buttons, pushbuttons). Variants PTH-12MM - 12mm square, through-hole Momentary Pushbutton Switch - 12mm Square <https://www.sparkfun.com/products/9190> (COM-09190) PTH-6.0MM, PTH-6.0MM-KIT - 6.0mm square, through-hole Mini Pushbutton Switch <https://www.sparkfun.com/products/97> (COM-00097) KIT package intended for soldering kit's - only one side of pads' copper is exposed. PTH-RIGHT-ANGLE-KIT - Right-angle, through-hole Right Angle Tactile Button <https://www.sparkfun.com/products/10791> - Used on SparkFun BigTime Watch Kit <https://www.sparkfun.com/products/11734> SMD-12MM - 12mm square, surface-mount Tactile Button - SMD (12mm) <https://www.sparkfun.com/products/12993> (COM-12993) Used on SparkFun PicoBoard <https://www.sparkfun.com/products/11888> SMD-4.5MM - 4.5mm Square Trackball Switch Used on SparkFun Blackberry Trackballer Breakout <https://www.sparkfun.com/products/13169> SMD-4.6MMX2.8MM - 4.60mm x 2.80mm, surface mount Used on SparkFun SAMD21 Mini Breakout <https://www.sparkfun.com/products/13664> SMD-5.2MM, SMD-5.2-REDUNDANT - 5.2mm square, surface-mount Mini Pushbutton Switch - SMD <https://www.sparkfun.com/products/8720> (COM-08720) Used on Arduino Pro Mini <https://www.sparkfun.com/products/11114> REDUNDANT package connects both switch circuits together SMD-6.0X3.5MM - 6.0 x 3.5mm, surface mount Momentary Reset Switch SMD <https://www.sparkfun.com/products/8229> (COM-08229) SMD-6.2MM-TALL - 6.2mm square, surface mount Tactile Button - SMD (6mm) <https://www.sparkfun.com/products/12992> Used on SparkFun Digital Sandbox <https://www.sparkfun.com/products/12651> SMD-RIGHT-ANGLE - Right-angle, surface mount Used on SparkFun Block for Intel® Edison - Arduino <https://www.sparkfun.com/products/13036>; PROD_ID: SWCH-11966; SF_SKU: COM-12992
TP1-TP17 = testpad:TP: Test pad
U1 = ESP32-DEVKITC-32D:ESP32-DEVKITC-32D: Eval Board For Esp-Wroom-32; AVAILABILITY: Unavailable; DESCRIPTION: EVAL BOARD FOR ESP-WROOM-32; MF: Espressif Systems; MP: ESP32-DEVKITC-32D; PACKAGE: None; PRICE: None
U2 = Texas Instruments - TPS563249DDCR:TEXAS_INSTRUMENTS_TPS563249DDCR: 17-V, 3-A, Constant 1.4-MHz Synchronous Step-Down Voltage Regulator; AUTOMOTIVE: No; CENTROID_NOT_SPECIFIED: No; DATASHEET: http://www.ti.com/lit/ds/symlink/tps563249.pdf; DEVICE_CLASS_L1: Integrated Circuits (ICs); DEVICE_CLASS_L2: Power Management ICs; DEVICE_CLASS_L3: Voltage Regulators - Switching; DIGIKEY_DESCRIPTION: IC 17-V, 3-A, CONSTANT 1.4-MHZ SYNC; DIGIKEY_PART_NUMBER: 296-53452-1-ND; FOOTPRINT_PARAMETERS_1: {"fp_type":"SOT23","params":{"N":{"default":"6","long name":"Number of leads","type":"multichoice","short name":"N"},"A":{"nom":false,"long name":"Height","min":false,"max":1100000,"short name":"A","type":"measurement"},"A1":{"nom":false,"long name":"Package clearance","min":0,"max":100000,"short name":"A1","type":"measurement"},"A2":{"nom":false,"long name":"Package height","min":700000,"max":1000000,"short name":"A2","type":"measurement"},"D":{"nom":false,"long name":"Package length","min":2750000,"max":3050000,"short name":"D","type":"measurement"},"E":{"nom":false,"long name":"Width /w leads","min":2550000,"max":3050000,"short name":"E","type":"measurement"},"E1":{"nom":false,"long name":"Package width","min":1450000,"max":1750000,"short name":"E1","type":"measurement"},"B":{"nom":false,"long name":"Lead width","min":300000,"max":500000,"short name":"B","type":"measurement"},"C":{"nom":false,"long name":"Lead thickness","min":120000,"max":200000,"short name":"C","type":"measurement"},"L":{"nom":false,"long name":"Lead foot length","min":300000,"max":600000,"short name":"L","type":"measurement"},"e":{"nom":950000,"long name":"Lead pitch","min":null,"max":null,"short name":"e","type":"measurement"},"PHI":{"nom":false,"long name":"Lead angle","min":0,"max":8,"short name":"PHI","type":"measurement"},"offset x":{"nom":0,"long name":"X Center offset","min":null,"max":null,"short name":"offset x","type":"measurement"},"offset y":{"nom":0,"long name":"Y Center offset","min":null,"max":null,"short name":"offset y","type":"measurement"},"LS":{"default":"Rounded rectangle","long name":"Land shape","type":"multichoice","short name":"LS"},"LS1":{"default":"Rectangle","long name":"Land shape (Pin 1)","type":"multichoice","short name":"LS1"},"solder toe":{"nom":550000,"long name":"Solder fillet (toe)","min":null,"max":null,"short name":"solder toe","type":"fixedmeasurement"},"solder heel":{"nom":450000,"long name":"Solder fillet (heel)","min":null,"max":null,"short name":"solder heel","type":"fixedmeasurement"},"solder side":{"nom":50000,"long name":"Solder fillet (side)","min":null,"max":null,"short name":"solder side","type":"fixedmeasurement"},"courtyard":{"nom":500000,"long name":"Courtyard","min":null,"max":null,"short name":"courtyard","type":"fixedmeasurement"},"SF":{"default":"A","long name":"Packing level","type":"multichoiceparent","short name":"SF","help":"http://support.upverter.com/customer/portal/articles/978783-what-is-a-footprint-packing-level","children":["solder toe","solder heel","solder side","courtyard"]}}}; FOOTPRINT_PARAMETERS_2: {"fp_type":"SOT23","params":{"N":{"default":"6","long name":"Number of leads","type":"multichoice","short name":"N"},"A":{"nom":false,"long name":"Height","min":false,"max":1100000,"short name":"A","type":"measurement"},"A1":{"nom":false,"long name":"Package clearance","min":0,"max":100000,"short name":"A1","type":"measurement"},"A2":{"nom":false,"long name":"Package height","min":700000,"max":1000000,"short name":"A2","type":"measurement"},"D":{"nom":false,"long name":"Package length","min":2750000,"max":3050000,"short name":"D","type":"measurement"},"E":{"nom":false,"long name":"Width /w leads","min":2550000,"max":3050000,"short name":"E","type":"measurement"},"E1":{"nom":false,"long name":"Package width","min":1450000,"max":1750000,"short name":"E1","type":"measurement"},"B":{"nom":false,"long name":"Lead width","min":300000,"max":500000,"short name":"B","type":"measurement"},"C":{"nom":false,"long name":"Lead thickness","min":120000,"max":200000,"short name":"C","type":"measurement"},"L":{"nom":false,"long name":"Lead foot length","min":300000,"max":600000,"short name":"L","type":"measurement"},"e":{"nom":950000,"long name":"Lead pitch","min":null,"max":null,"short name":"e","type":"measurement"},"PHI":{"nom":false,"long name":"Lead angle","min":0,"max":8,"short name":"PHI","type":"measurement"},"offset x":{"nom":0,"long name":"X Center offset","min":null,"max":null,"short name":"offset x","type":"measurement"},"offset y":{"nom":0,"long name":"Y Center offset","min":null,"max":null,"short name":"offset y","type":"measurement"},"LS":{"default":"Rounded rectangle","long name":"Land shape","type":"multichoice","short name":"LS"},"LS1":{"default":"Rectangle","long name":"Land shape (Pin 1)","type":"multichoice","short name":"LS1"},"solder toe":{"nom":350000,"long name":"Solder fillet (toe)","min":null,"max":null,"short name":"solder toe","type":"fixedmeasurement"},"solder heel":{"nom":350000,"long name":"Solder fillet (heel)","min":null,"max":null,"short name":"solder heel","type":"fixedmeasurement"},"solder side":{"nom":30000,"long name":"Solder fillet (side)","min":null,"max":null,"short name":"solder side","type":"fixedmeasurement"},"courtyard":{"nom":250000,"long name":"Courtyard","min":null,"max":null,"short name":"courtyard","type":"fixedmeasurement"},"SF":{"default":"B","long name":"Packing level","type":"multichoiceparent","short name":"SF","help":"http://support.upverter.com/customer/portal/articles/978783-what-is-a-footprint-packing-level","children":["solder toe","solder heel","solder side","courtyard"]}}}; FOOTPRINT_PARAMETERS_3: {"fp_type":"SOT23","params":{"N":{"default":"6","long name":"Number of leads","type":"multichoice","short name":"N"},"A":{"nom":false,"long name":"Height","min":false,"max":1100000,"short name":"A","type":"measurement"},"A1":{"nom":false,"long name":"Package clearance","min":0,"max":100000,"short name":"A1","type":"measurement"},"A2":{"nom":false,"long name":"Package height","min":700000,"max":1000000,"short name":"A2","type":"measurement"},"D":{"nom":false,"long name":"Package length","min":2750000,"max":3050000,"short name":"D","type":"measurement"},"E":{"nom":false,"long name":"Width /w leads","min":2550000,"max":3050000,"short name":"E","type":"measurement"},"E1":{"nom":false,"long name":"Package width","min":1450000,"max":1750000,"short name":"E1","type":"measurement"},"B":{"nom":false,"long name":"Lead width","min":300000,"max":500000,"short name":"B","type":"measurement"},"C":{"nom":false,"long name":"Lead thickness","min":120000,"max":200000,"short name":"C","type":"measurement"},"L":{"nom":false,"long name":"Lead foot length","min":300000,"max":600000,"short name":"L","type":"measurement"},"e":{"nom":950000,"long name":"Lead pitch","min":null,"max":null,"short name":"e","type":"measurement"},"PHI":{"nom":false,"long name":"Lead angle","min":0,"max":8,"short name":"PHI","type":"measurement"},"offset x":{"nom":0,"long name":"X Center offset","min":null,"max":null,"short name":"offset x","type":"measurement"},"offset y":{"nom":0,"long name":"Y Center offset","min":null,"max":null,"short name":"offset y","type":"measurement"},"LS":{"default":"Rounded rectangle","long name":"Land shape","type":"multichoice","short name":"LS"},"LS1":{"default":"Rectangle","long name":"Land shape (Pin 1)","type":"multichoice","short name":"LS1"},"solder toe":{"nom":150000,"long name":"Solder fillet (toe)","min":null,"max":null,"short name":"solder toe","type":"fixedmeasurement"},"solder heel":{"nom":250000,"long name":"Solder fillet (heel)","min":null,"max":null,"short name":"solder heel","type":"fixedmeasurement"},"solder side":{"nom":10000,"long name":"Solder fillet (side)","min":null,"max":null,"short name":"solder side","type":"fixedmeasurement"},"courtyard":{"nom":100000,"long name":"Courtyard","min":null,"max":null,"short name":"courtyard","type":"fixedmeasurement"},"SF":{"default":"C","long name":"Packing level","type":"multichoiceparent","short name":"SF","help":"http://support.upverter.com/customer/portal/articles/978783-what-is-a-footprint-packing-level","children":["solder toe","solder heel","solder side","courtyard"]}}}; FOOTPRINT_URL: http://www.ti.com/lit/ds/symlink/tlv700.pdf; FOOTPRINT_VARIANT_NAME_0: Recommended_Land_Pattern; FOOTPRINT_VARIANT_NAME_1: IPC_A; FOOTPRINT_VARIANT_NAME_2: IPC_B; FOOTPRINT_VARIANT_NAME_3: IPC_C; HEIGHT: 1.1mm; IPC_LAND_PATTERN_NAME: SOT95P280X110-6; LEAD_FREE: Yes; MAX_JUNCTION_TEMP: +125°C; MAX_SUPPLY_VOLTAGE: 17V; MF: Texas Instruments; MFG_PACKAGE_IDENT: DDC0005A; MFG_PACKAGE_IDENT_DATE: 0; MFG_PACKAGE_IDENT_REV: 0; MIN_SUPPLY_VOLTAGE: 4.5V; MOUSER_PART_NUMBER: 595-TPS563249DDCR; MPN: TPS563249DDCR; NUMBER_OF_OUTPUTS: 1; OUTPUT_CURRENT: 3A; OUTPUT_TYPE: AdjustableProgrammable; OUTPUT_VOLTAGE: 0.6-7V; PACKAGE: SOT-23-THIN; PREFIX: U; ROHS: Yes; STANDOFF_HEIGHT: 0mm; SWITCHING_FREQUENCY: 1.4MHz; SWITCHING_TOPOLOGY: Buck; TEMPERATURE_RANGE_HIGH: +125°C; TEMPERATURE_RANGE_LOW: -40°C; VERIFICATION_VERSION: 0.0.0.2
U3 = Maxim Electronics - MAX7221CWG:MAXIM_ELECTRONICS_MAX7221CWG: Serially Interfaced, 8-Digit LED Display Drivers; CENTROID_NOT_SPECIFIED: No; DATASHEET: http://pdfserv.maxim-ic.com/en/ds/MAX7219-MAX7221.pdf; DIGIKEY_DESCRIPTION: IC DRIVER LED DISP 8DGT 24-SOIC; DIGIKEY_PART_NUMBER: MAX7221CWG+-ND; LAND_PATTERN: http://pdfserv.maximintegrated.com/land_patterns/90-0182.PDF; LEAD_FREE: yes; MECHANICAL_DETAILS: http://pdfserv.maximintegrated.com/package_dwgs/21-0042.PDF; MF: Maxim Electronics; MOUSER_PART_NUMBER: 700-MAX7221CWG; MPN: MAX7221CWG; PACKAGE: SO24; PREFIX: U; ROHS: yes; TEMPERATURE_RANGE_HIGH: +70°C; TEMPERATURE_RANGE_LOW: 0°C
U4 = Texas Instruments - ADS1015IDGST:TEXAS_INSTRUMENTS_ADS1015IDGST: TI-ADS1015_1115-10; ANALOG_VOLTAGE_AVDDMAXV: 5.5; ANALOG_VOLTAGE_AVDDMINV: 2; ARCHITECTURE: Delta-Sigma; CIIVA_IDS: 19361519; CODE__JEDEC: MO-153; COMPONENT_LINK_1_DESCRIPTION: Manufacturer URL; COMPONENT_LINK_1_URL: http://www.ti.com/; COMPONENT_LINK_3_DESCRIPTION: Package Specification; COMPONENT_LINK_3_URL: http://www.ti.com/lit/ml/mpds035b/mpds035b.pdf; DATASHEET: http://www.ti.com/general/docs/lit/getliterature.tsp?genericPartNumber=ADS1015&fileType=pdf; DATASHEET_VERSION: SBAS473C; DIGITAL_SUPPLYMAXV: 5.5; DIGITAL_SUPPLYMINV: 2; FOOTPRINT_VARIANT_NAME_0: Level C; FOOTPRINT_VARIANT_NAME_1: Level B; FOOTPRINT_VARIANT_NAME_2: Level A; IMPORTED: yes; IMPORTED_FROM: vault; IMPORT_TS: 1521859698; INL_MAX__LSB: 0.5; INPUT_CHANNELS: 4; INTERFACE: Serial I2C; MF: Texas Instruments; MOUNTING_TECHNOLOGY: Surface Mount; MPN: ADS1015IDGST; PACKAGE: DGS10; PACKAGE_DESCRIPTION: 10-Pin Plastic Small Outline, Body 3 x 3 mm, Pitch 0.5 mm; PACKAGE_VERSION: 4073272/C, 02/2004; PIN_0_0_9_INSIDE_EDGE: clock; PREFIX: U; RELEASE_DATE: 1425632942; RESOLUTION_BITS: 12; ROHS: Yes; SAMPLE_RATE_MAXSPS: 3.3k; SUB_FAMILY: Precision ADC (<=10MSPS); VAULT_GUID: 2E6E2168-9EC8-4055-94E3-9149772017F1; VAULT_REVISION: AEC372CC-F1D8-454F-AFE4-4D27D8F33420
U5 U6 = Texas Instruments - PCF8574PW:TEXAS_INSTRUMENTS_PCF8574PW: TI-PCF8574-TSSOP_PW-20; CIIVA_IDS: 13592403; CODE__JEDEC: MO-153; DATASHEET: http://www.ti.com/general/docs/lit/getliterature.tsp?genericPartNumber=PCF8574&fileType=pdf; DATASHEET_VERSION: SCPS068G; FOOTPRINT_VARIANT_NAME_0: Level C; FOOTPRINT_VARIANT_NAME_1: Level B; FOOTPRINT_VARIANT_NAME_2: Level A; F_SCLK_MAX_MHZ: 0.1; I2C_ADDRESS: 0100 xxx; IMPORTED: yes; IMPORTED_FROM: vault; IMPORT_TS: 1521851597; INTERRUPT_OUTPUT: Yes; MAX_FREQUENCYKHZ: 100; MF: Texas Instruments; MOUNTING_TECHNOLOGY: Surface Mount; MPN: PCF8574PW; OF_IOS: 8; PACKAGE: PW0020A; PACKAGE_DESCRIPTION: 20-Pin Plastic Thin Small Outline Package 6.5 x 4.4 mm Body ,0.65 mm Pitch; PACKAGE_VERSION: revG, Feb-2011; PIN_0_0_1_INSIDE_EDGE: clock; PREFIX: U; PUSH_PULL_IO_TYPE: Yes; RELEASE_DATE: 1464327301; RESET_INPUT: No; ROHS: Yes; SUB_FAMILY: I2C IO Expander; VAULT_GUID: B89E52F6-682C-408F-B17E-30259E6517C8; VAULT_REVISION: 4F22D391-4A69-4D57-9F5D-B39C2B5A34D1; VCC_MAX_V: 6; VCC_MIN_V: 2.5; VCC_RANGEV: 2.5 to 6.0; VOLTAGE_NODESV: 5, 3.3
X1 X3 X5 = con-wago-500:W237-102: WAGO SCREW CLAMP; MPN: 237-102; OC_FARNELL: unknown; OC_NEWARK: 70K9898
X2 X4 X6 = con-wago-500:W237-103: WAGO SCREW CLAMP; MPN: 237-103; OC_FARNELL: unknown; OC_NEWARK: 18M7116

## Board
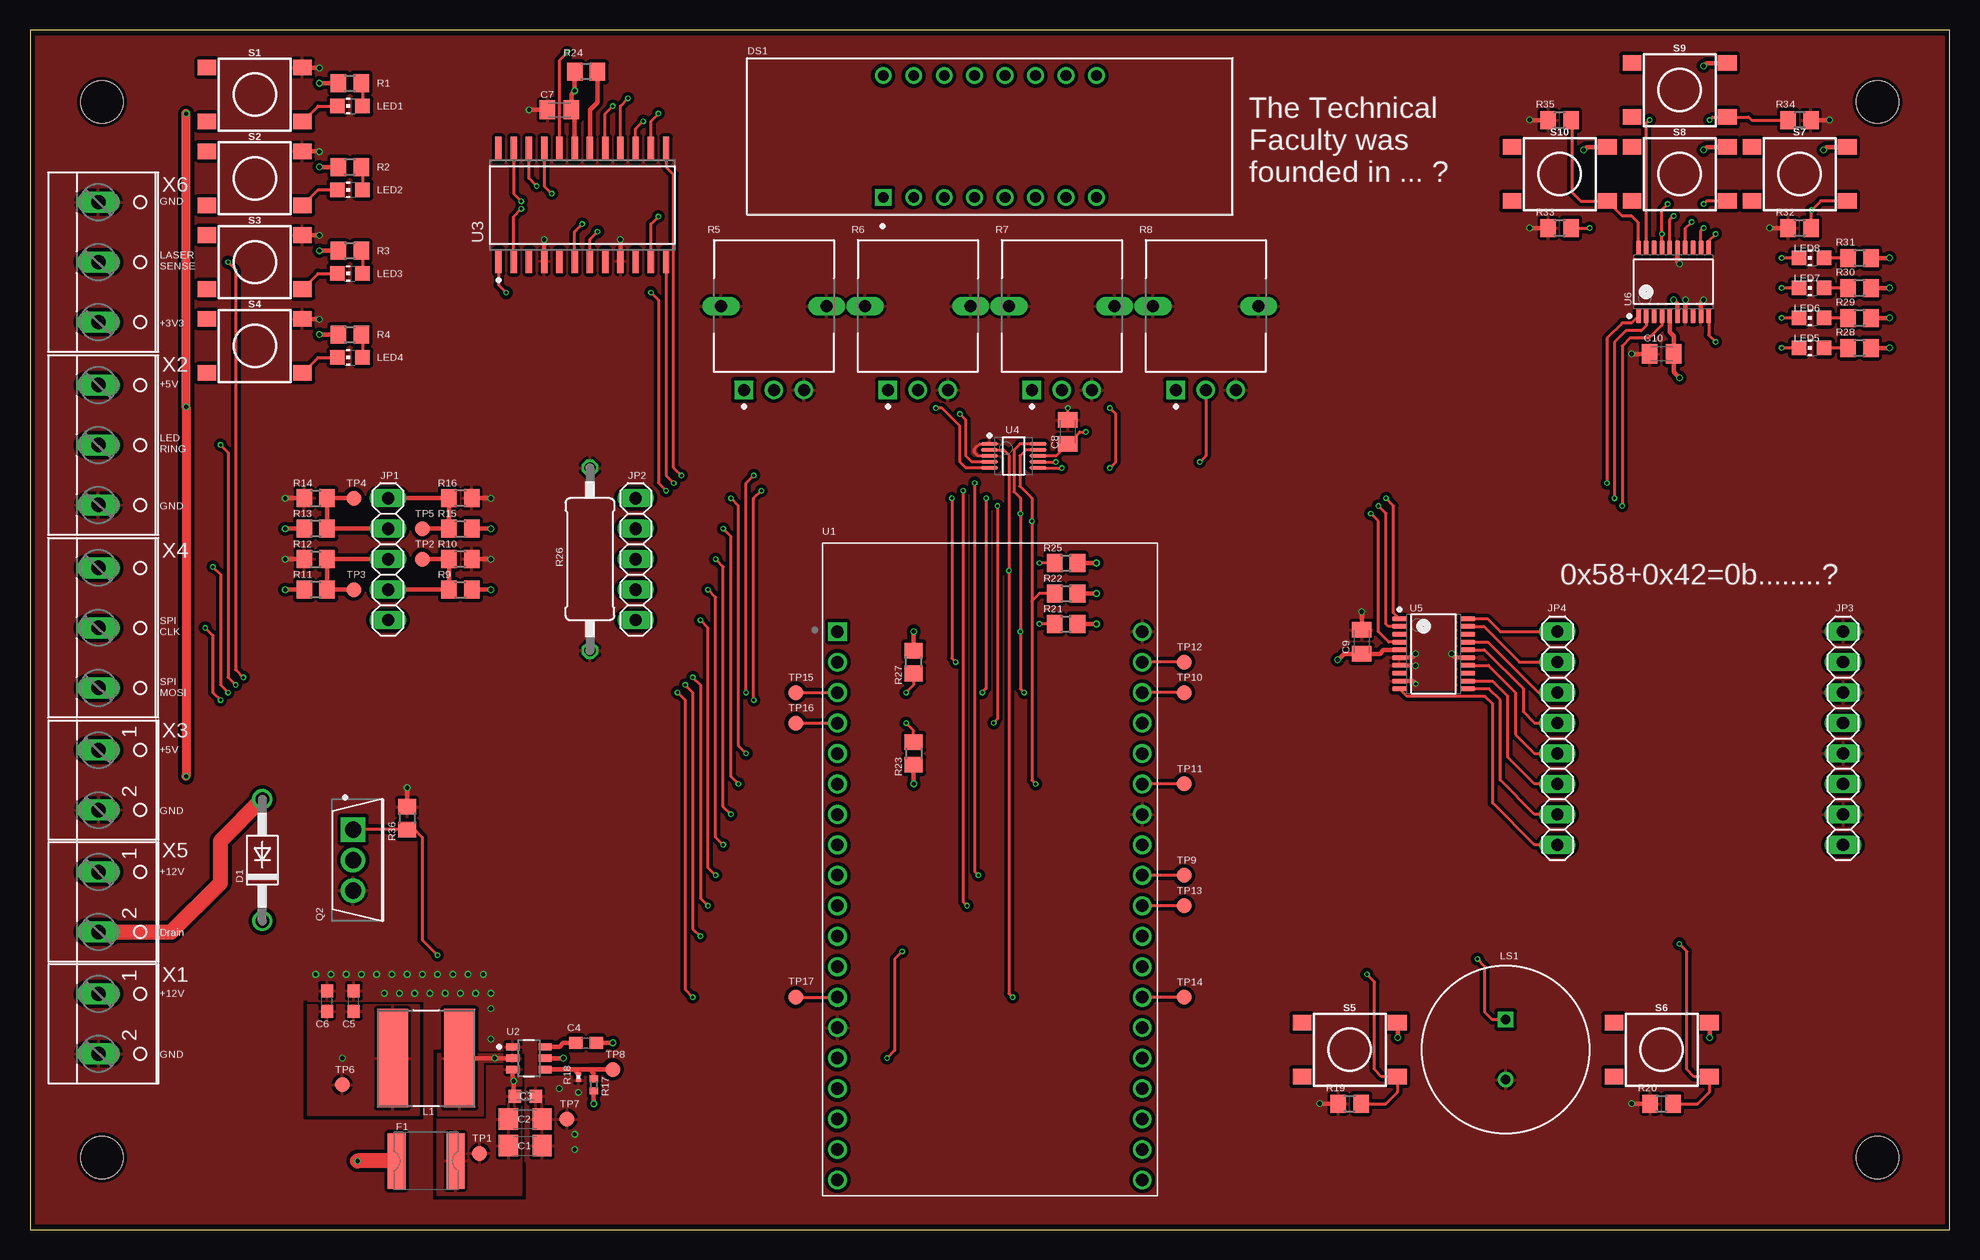
[diagram p6: board, top side]
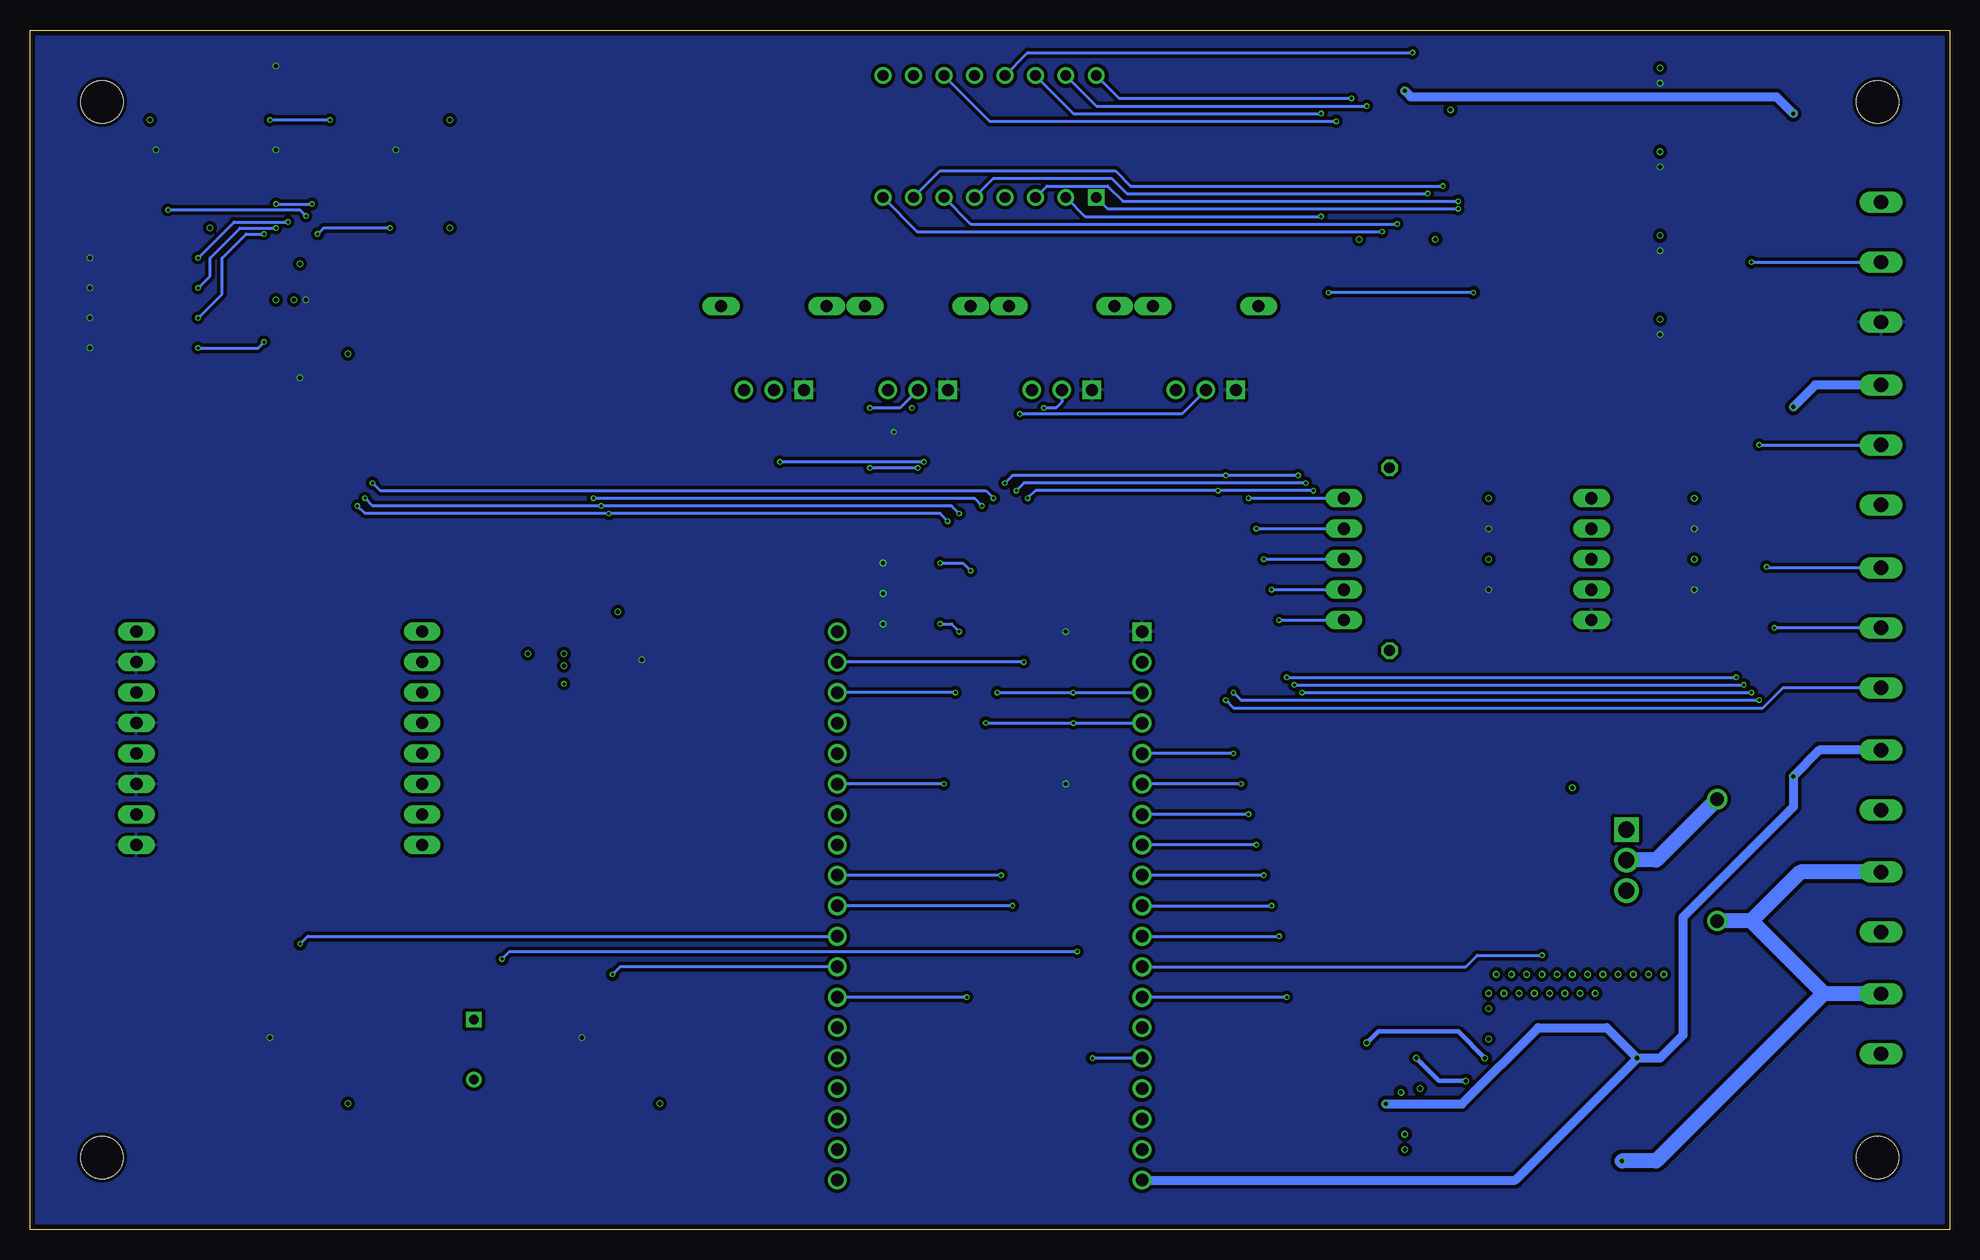
[diagram p7: board, bottom side, seen from below]

Size 160 x 100 mm. Coordinates in mm from the lower left corner, seen from the top.
Outline: 0,0 160,0 160,100 0,100 0,0
Copper layers (1*16): Top 0.035mm / dielectric 0.2mm / Bottom 0.035mm
Design rules "jlcpcb2layer": minimum track width 3.5mil, minimum drill 0.2mm, track to track 3.5mil, track to pad 5mil, pad to pad 5mil, via to via 5mil, smd to smd 0mil, copper to edge 0.1mm, drill to drill 5mil, minimum pad ring 4mil, minimum via ring 4mil, stop-mask expansion 3mil, vias tented up to drill 100mil, thermal gap 10mil
Holes 3.5 mm at 6,6 6,94 154,94 154,6

### Footprints (pad centres in the part's own frame; a part is rotated, then mirrored left to right if it is on the bottom)
C1206 = smd 1.6 x 1.8: 1 -1.4,0; 2 1.4,0
C0603K = smd 1.05 x 1.08: 1 -0.875,0; 2 0.875,0
C0603 = smd 1.1 x 1: 1 -0.85,0; 2 0.85,0
C0805K = smd 1.3 x 1.6: 1 -1,0; 2 1,0
DO41-10 = drill 1.118: A 5.08,0; C -5.08,0
VISHAY_TDCG1060M_0 = drill 0.9 pad 1.4 square: 1 -8.89,-5.08 | drill 0.9 pad 1.4: 2 -6.35,-5.08; 3 -3.81,-5.08; 4 -1.27,-5.08; 5 1.27,-5.08; 6 3.81,-5.08; 7 6.35,-5.08; 8 8.89,-5.08; 9 8.89,5.08; 10 6.35,5.08; 11 3.81,5.08; 12 1.27,5.08; 13 -1.27,5.08; 14 -3.81,5.08; 15 -6.35,5.08; 16 -8.89,5.08
MF-SMDF050 = smd 1.5 x 4.6: 1 -2.45,0; 2 2.45,0
1X05 = drill 1.016 long: 1 -5.08,0; 2 -2.54,0; 3 0,0; 4 2.54,0; 5 5.08,0
1X08 = drill 1.016 long: 1 -8.89,0; 2 -6.35,0; 3 -3.81,0; 4 -1.27,0; 5 1.27,0; 6 3.81,0; 7 6.35,0; 8 8.89,0
BOURNS_SRN8040-1R5Y_0 = smd 2.6 x 8.2: 1 -2.8,0; 2 2.8,0
CHIP-LED0805 = smd 1.2 x 1.2: A 0,-1.05; C 0,1.05
TDK_PS1420P02CT_0 = drill 0.8 pad 1.3 square: 1 -2.5,0 | drill 0.8 pad 1.3: 2 2.5,0
INFINEON_IRLB8721PBF_0 = drill 1.35 pad 2.05 square: 1 -0.378,2.54 | drill 1.35 pad 2.05: 2 -0.378,0; 3 -0.378,-2.54
R0805 = smd 1.3 x 1.5: 1 -0.95,0; 2 0.95,0
BOURNS_PTV09A-4020F-A103_0 = drill 1 pad 1.55 square: 1 -2.5,-7 | drill 1 pad 1.55: 2 0,-7; 3 2.5,-7 | drill 1 pad 1.55 long: 4 -4.4,0; 5 4.4,0
R0402 = smd 0.6 x 0.7: 1 -0.5,0; 2 0.5,0
R0201 = smd 0.28 x 0.43: 1 -0.255,0; 2 0.255,0
0411/15 = drill 0.914 octagon: 1 -7.62,0; 2 7.62,0
TACTILE_SWITCH_SMD_6.2MM_TALL = smd 1.55 x 1.3: A1 -3.975,-2.25; A2 3.975,-2.25; B1 -3.975,2.25; B2 3.975,2.25
B1,27 = smd 1.27 x 1.27: TP 0,0
MODULE_ESP32-DEVKITC-32D = drill 1.04 square: 1 -12.7,19.76 | drill 1.04: 2 -12.7,17.22; 3 -12.7,14.68; 4 -12.7,12.14; 5 -12.7,9.6; 6 -12.7,7.06; 7 -12.7,4.52; 8 -12.7,1.98; 9 -12.7,-0.56; 10 -12.7,-3.1; 11 -12.7,-5.64; 12 -12.7,-8.18; 13 -12.7,-10.72; 14 -12.7,-13.26; 15 -12.7,-15.8; 16 -12.7,-18.34; 17 -12.7,-20.88; 18 -12.7,-23.42; 19 -12.7,-25.96; 20 12.7,19.76; 21 12.7,17.22; 22 12.7,14.68; 23 12.7,12.14; 24 12.7,9.6; 25 12.7,7.06; 26 12.7,4.52; 27 12.7,1.98; 28 12.7,-0.56; 29 12.7,-3.1; 30 12.7,-5.64; 31 12.7,-8.18; 32 12.7,-10.72; 33 12.7,-13.26; 34 12.7,-15.8; 35 12.7,-18.34; 36 12.7,-20.88; 37 12.7,-23.42; 38 12.7,-25.96
TEXAS_INSTRUMENTS_TPS563249DDCR_0 = smd 1.1 x 0.6: 1 -1.35,0.95; 2 -1.35,0; 3 -1.35,-0.95; 4 1.35,-0.95; 5 1.35,0; 6 1.35,0.95
MAXIM_ELECTRONICS_MAX7221CWG_0 = smd 0.533 x 1.981: 1 -6.985,-4.686; 2 -5.715,-4.686; 3 -4.445,-4.686; 4 -3.175,-4.686; 5 -1.905,-4.686; 6 -0.635,-4.686; 7 0.635,-4.686; 8 1.905,-4.686; 9 3.175,-4.686; 10 4.445,-4.686; 11 5.715,-4.686; 12 6.985,-4.686; 13 6.985,4.686; 14 5.715,4.686; 15 4.445,4.686; 16 3.175,4.686; 17 1.905,4.686; 18 0.635,4.686; 19 -0.635,4.686; 20 -1.905,4.686; 21 -3.175,4.686; 22 -4.445,4.686; 23 -5.715,4.686; 24 -6.985,4.686
TEXAS_INSTRUMENTS_ADS1015IDGST_0 = smd 1.45 x 0.25: 1 -2.025,1; 2 -2.025,0.5; 3 -2.025,0; 4 -2.025,-0.5; 5 -2.025,-1; 6 2.025,-1; 7 2.025,-0.5; 8 2.025,0; 9 2.025,0.5; 10 2.025,1
TEXAS_INSTRUMENTS_PCF8574PW_0 = smd 1.2 x 0.4: 1 -2.85,2.925; 2 -2.85,2.275; 3 -2.85,1.625; 4 -2.85,0.975; 5 -2.85,0.325; 6 -2.85,-0.325; 7 -2.85,-0.975; 8 -2.85,-1.625; 9 -2.85,-2.275; 10 -2.85,-2.925; 11 2.85,-2.925; 12 2.85,-2.275; 13 2.85,-1.625; 14 2.85,-0.975; 15 2.85,-0.325; 16 2.85,0.325; 17 2.85,0.975; 18 2.85,1.625; 19 2.85,2.275; 20 2.85,2.925
W237-102 = drill 1.194 long: 1 -2.5,-1.27; 2 2.5,-1.27
W237-103 = drill 1.194 long: 1 -5,-1.29; 2 0,-1.29; 3 5,-1.29

### Placement (x,y rotation side)
C1  41.27,6.99 0 top
C2  41.27,9.21 0 top
C3  41.27,11.11 0 top
C4  46.35,15.56 0 top
C5  26.99,19.05 90 top
C6  24.77,19.05 90 top
C7  44.13,93.34 180 top
C8  86.5,66.5 90 top
C9  111,49 90 top
C10  136,73 180 top
D1  19.37,30.8 90 top
DS1  80.01,91.12 0 top
F1  33.02,5.71 0 top
JP1  29.84,55.88 90 top
JP2  50.48,55.88 90 top
JP3  151.13,40.96 90 top
JP4  127.32,40.96 90 top
L1  33.02,14.29 180 top
LED1  26.67,93.66 90 top
LED2  26.67,86.68 90 top
LED3  26.67,79.69 90 top
LED4  26.67,72.71 90 top
LED5  148.5,73.5 90 top
LED6  148.5,76 90 top
LED7  148.5,78.5 90 top
LED8  148.5,81 90 top
LS1  123,15 270 top
Q2  27.3,30.8 0 top
R1  26.67,95.57 0 top
R2  26.67,88.58 0 top
R3  26.67,81.6 0 top
R4  26.67,74.61 0 top
R5  62,77 0 top
R6  74,77 0 top
R7  86,77 0 top
R8  98,77 0 top
R9  35.88,53.34 0 top
R10  35.88,55.88 180 top
R11  23.81,53.34 180 top
R12  23.81,55.88 0 top
R13  23.81,58.42 180 top
R14  23.81,60.96 0 top
R15  35.88,58.42 0 top
R16  35.88,60.96 180 top
R17  46.99,12.06 270 top
R18  45.72,12.7 90 top
R19  110,10.5 0 top
R20  136,10.5 0 top
R21  86.36,50.48 0 top
R22  86.36,53.02 0 top
R23  73.66,39.69 270 top
R24  46.35,96.52 180 top
R25  86.36,55.56 0 top
R26  46.67,55.88 270 top
R27  73.66,47.31 90 top
R28  152.5,73.5 0 top
R29  152.5,76 0 top
R30  152.5,78.5 0 top
R31  152.5,81 0 top
R32  147.5,83.5 0 top
R33  127.5,83.5 0 top
R34  147.5,92.5 180 top
R35  127.5,92.5 0 top
R36  31.43,34.29 270 top
S1  18.73,94.61 0 top
S2  18.73,87.63 0 top
S3  18.73,80.64 0 top
S4  18.73,73.66 0 top
S5  110,15 0 top
S6  136,15 0 top
S7  147.5,88 0 top
S8  137.5,88 0 top
S9  137.5,95 0 top
S10  127.5,88 0 top
TP1  37.47,6.35 0 top
TP2  32.7,55.88 180 top
TP3  26.99,53.34 180 top
TP4  26.99,60.96 180 top
TP5  32.7,58.42 180 top
TP6  26.04,12.06 0 top
TP7  44.77,9.21 0 top
TP8  48.58,13.34 0 top
TP9  96.2,29.53 0 top
TP10  96.2,44.77 0 top
TP11  96.2,37.15 0 top
TP12  96.2,47.31 0 top
TP13  96.2,26.99 0 top
TP14  96.2,19.37 0 top
TP15  63.82,44.77 0 top
TP16  63.82,42.23 0 top
TP17  63.82,19.37 0 top
U1  80.01,30.08 0 top
U2  41.59,14.29 0 top
U3  46.04,85.41 0 top
U4  82,64.5 0 top
U5  117,48 0 top
U6  137,79 90 top
X1  6.99,17.14 270 top
X2  6.99,65.41 270 top
X3  6.99,37.47 270 top
X4  6.99,50.16 270 top
X5  6.99,27.3 270 top
X6  6.99,80.64 270 top

### Tracks (layer width: path | path; a pad name or v marks a point on that pad's centre or on a via)
+0V9
  Top 0.381: JP1.5 R16.2 R15.1 TP5.TP
+1V5
  Top 0.381: TP4.TP R14.2 R13.1 JP1.4
+2V1
  Top 0.381: JP1.3 R12.2 R11.1 TP3.TP
+2V7
  Top 0.381: TP2.TP R10.2 R9.1 JP1.2
+3V3  (via drill 0.25, 0.35)
  Top 0.254: U4.8 85.5,64.5 C8.1 87.5,66.5 v88,66.5
  Top 0.381: R15.2 v38.42,58.42 | R9.2 v38.42,53.34 | R13.2 v21.27,58.42 | R11.2 v21.27,53.34 | R28.2 v155,73.5 | R29.2 v155,76 | R30.2 v155,78.5 | R31.2 v155,81 | S10.B2 129.75,90.25 v129.5,90 | S8.B2 139.75,90.25 v139.5,90 | S7.B2 149.75,90.25 v149.5,90 | S9.B2 139.75,97.25 v139.5,97 | U6.5 136.68,74.83 137,74.5 C10.1 137,71.5 v137.5,71 | U6.6 137.32,77.17 v137,77.5 | U5.5 112.83,48.33 112.5,48 C9.1 109.5,48 v109,47.5 | S6.B2 140,17.23 v140,16 | S5.B2 114,17.23 v114,16 | R25.2 v88.9,55.56 | R22.2 v88.9,53.02 | R21.2 v88.9,50.48 | R27.2 v73.66,49.85 | R23.2 v73.66,37.15 | R1.1 v24.13,95.57 | R2.1 v24.13,88.58 | R3.1 v24.13,81.6 | R4.1 v24.13,74.61
  pour Bottom (isolate 0.3): 0.5,0.5 159.5,0.5 159.5,99.5 0.5,99.5
+5V  (via drill 0.35)
  Top 0.381: R17.2 v46.99,10.48 | U3.19 45.4,93.08 C7.1 45.13,94.66 v45.41,94.94 R24.2
  Top 0.762: v13.02,37.78 v13.02,68.58 v13.02,93.03
  Bottom 0.762: v46.99,10.48 40.64,10.48 34.29,16.83 28.57,16.83 v26.04,14.29 | X2.1 11.19,70.41 v13.02,68.58 | X3.1 10.84,39.97 v13.02,37.78 13.02,35.24 22.23,26.04 22.23,16.19 24.13,14.29 v26.04,14.29 | U1.19 36.2,4.12 v26.04,14.29 | v45.41,94.94 44.91,94.44 14.43,94.44 v13.02,93.03
  pour Top: 23.18,18.73 32.38,18.73 32.38,9.53 23.18,9.53
+12V  (via drill 0.35)
  Top 1.27: F1.1 v27.3,5.71
  Bottom 1.27: X5.1 12.42,29.8 16.51,25.72 | X1.1 10.52,19.64 | 10.52,19.64 24.45,5.71 v27.3,5.71 | 16.51,25.72 D1.C | 10.52,19.64 10.52,19.73 16.51,25.72
ADC_RDY  (via drill 0.25)
  Top 0.254: U4.2 81.18,65 81.6,64.58 v81.6,54.93 81.6,19.68 v81.92,19.37 | R25.1 v84.14,55.56 | TP14.TP U1.32
  Bottom 0.254: v81.92,19.37 U1.32 | v84.14,55.56 82.23,55.56 v81.6,54.93
BUTTON_0  (via drill 0.25)
  Top 0.254: R19.2 113,10.5 114,11.5 114,12.72 S5.A2 112.66,12.75 112.08,13.34 112.08,20.64 v111.44,21.27
  Bottom 0.254: U1.31 109.22,21.9 109.22,21.91 110.81,21.91 v111.44,21.27
BUTTON_1  (via drill 0.25)
  Top 0.254: R20.2 139,10.5 140,11.5 140,12.72 S6.A2 138.7,12.75 138.11,13.34 138.11,23.18 v137.48,23.81
  Bottom 0.254: v137.48,23.81 136.84,24.45 U1.30
CS_MAX7219_LEDM  (via drill 0.25)
  Top 0.254: v15.24,55.24 15.88,54.61 15.88,45.4 v16.51,44.77 | v53.98,44.77 54.61,44.13 54.61,20 v55.24,19.37 | TP17.TP U1.13
  Bottom 0.254: X4.1 15.16,55.16 v15.24,55.24 | v53.98,44.77 v16.51,44.77 | v55.24,19.37 v55.25,19.36 U1.13
CS_MAX7221_7SEG  (via drill 0.25)
  Top 0.254: U3.12 53.02,62.87 v53.66,62.23 | v78.11,26.99 77.79,27.3 v77.79,61.59 | TP13.TP U1.29
  Bottom 0.254: v77.79,61.59 77.15,62.23 v53.66,62.23 | v78.11,26.99 U1.29
DIG_0  (via drill 0.25)
  Top 0.254: U3.2 40.32,84.45 v40.96,85.09
  Bottom 0.254: DS1.1 70.17,85.09 v40.96,85.09
DIG_1  (via drill 0.25)
  Top 0.254: U3.11 51.75,83.82 v52.39,84.45
  Bottom 0.254: DS1.2 72.07,84.45 v52.39,84.45
DIG_2  (via drill 0.25)
  Top 0.254: U3.6 45.4,83.19 v46.04,83.82
  Bottom 0.254: DS1.6 81.6,83.82 v46.04,83.82
DIG_3  (via drill 0.25)
  Top 0.254: U3.7 46.67,82.55 v47.31,83.19
  Bottom 0.254: DS1.8 86.04,83.19 v47.31,83.19
GND  (via drill 0.25, 0.35)
  Top 0.254: C8.2 v86.5,68.5 | U4.3 79.01,64.5 78.74,64.77 78.74,65.09 79.15,65.5 U4.1
  Top 0.381: C7.2 v41.59,93.34 | U3.4 v42.86,82.55 | U3.9 v49.21,82.55 | R16.1 v38.42,60.96 | R10.1 v38.42,55.88 | R14.1 v21.27,60.96 | R12.1 v21.27,55.88 | R35.1 v125,92.5 | R33.1 v125,83.5 | R34.1 v150,92.5 | R32.1 v145,83.5 | U6.15 137.32,80.67 v137.5,80.5 | U6.7 137.97,77.47 v138,77.5 | U6.9 139.28,77.28 v139.5,77.5 | C10.2 v133.5,73 | U5.15 118.83,47.67 v118.5,48 | U5.6 115.17,47.67 v115.5,48 | U5.7 115.47,47.02 v115.5,47 | U5.9 115.28,45.73 v115.5,45.5 | C9.2 v111,51.5 | R19.1 v107.5,10.5 | R20.1 v133.5,10.5 | R36.1 v31.43,36.83 | S1.B2 24.1,96.86 v24.13,96.84 | S2.B2 24.1,89.88 v24.13,89.85 | S3.B2 24.1,82.89 v24.13,82.87 | S4.B2 24.1,75.91 v24.13,75.88
  other vias: 23.81,21.27 26.35,21.27 35.24,21.27 32.7,21.27 33.97,21.27 31.43,21.27 37.78,21.27 35.88,19.68 28.89,21.27 30.16,21.27 27.62,21.27 34.61,19.68 33.34,19.68 32.07,19.68 30.8,19.68 25.08,21.27 29.53,19.68 36.51,21.27 37.15,19.68 38.42,19.68 38.42,18.41 38.42,15.88 44.13,11.75 45.72,11.43 45.4,7.94 45.4,6.67
  pour Top: 41.27,14.92 41.27,5.71 46.35,5.71 46.35,12.7 42.23,12.7 42.23,16.51 39.37,16.51 39.37,21.91 23.18,21.91 23.18,19.05 37.47,19.05 37.47,14.92
  pour Top (isolate 0.3, rank 2): 0.5,0.5 0.5,99.5 159.5,99.5 159.5,0.5
LASER_SENSE  (via drill 0.25)
  Top 0.254: v17.78,46.04 17.14,46.67 17.14,80.01 v16.51,80.64 | v55.24,46.04 55.88,45.4 55.88,27.62 v56.52,26.99
  Bottom 0.254: v16.51,80.64 X6.2 | v55.24,46.04 v17.78,46.04 | U1.10 v56.52,26.98 v56.52,26.99
LED_RING  (via drill 0.25)
  Top 0.254: v15.88,65.41 16.51,64.77 16.51,46.04 v17.14,45.4 | v54.61,45.4 55.24,44.77 55.24,25.08 v55.88,24.45
  Bottom 0.254: v15.88,65.41 X2.2 | v54.61,45.4 v17.14,45.4 | U1.11 v55.88,24.44 v55.88,24.45
LOCK_0  (via drill 0.25)
  Top 0.254: v33.97,22.86 32.7,24.13 32.7,32.7 32.07,33.34 R36.2 Q2.1
  Bottom 0.254: U1.12 40.33,21.9 39.37,22.86 v33.97,22.86
N$1
  Top 0.254: R1.2 27.72,95.47 LED1.A
N$2
  Top 0.254: R2.2 27.72,88.48 LED2.A
N$3
  Top 0.254: R3.2 27.72,81.5 LED3.A
N$4
  Top 0.254: R4.2 27.72,74.51 LED4.A
N$5
  Top 0.254: S1.A2 24,93.66 LED1.C
N$7
  Top 0.254: S2.A2 24,86.68 LED2.C
N$9
  Top 0.254: S3.A2 24,79.69 LED3.C
N$11
  Top 0.254: S4.A2 24,72.71 LED4.C
N$17
  Top 0.254: R28.1 LED5.A
N$18  (via drill 0.35)
  Top 0.381: U2.5 v44.45,14.29 | U2.3 40.24,12.46 v40.32,12.38 40.32,11.19 C3.1
  Bottom 0.381: v44.45,14.29 42.55,12.38 v40.32,12.38
  pour Top: 38.1,13.65 40.96,13.65 40.96,2.86 33.97,2.86 33.97,9.21 38.1,9.21
N$19  (via drill 0.25)
  Top 0.254: U6.10 139.93,74.58 v140.5,74 | LED5.C v146,73.5
  Bottom 0.254: v146,73.5 141,73.5 v140.5,74
N$20
  Top 0.254: R29.1 LED6.A
N$21  (via drill 0.25)
  Top 0.254: LED6.C v146,76 | U6.11 139.93,82.42 v140.5,83
  Bottom 0.254: v146,76 144,78 144,81 142,83 v140.5,83
N$22
  Top 0.254: R30.1 LED7.A
N$23
  Top 0.381: U3.18 46.67,93.34 47.31,93.98 R24.1
N$24  (via drill 0.25)
  Top 0.254: LED7.C v146,78.5 | U6.12 139.28,83.28 v139.5,83.5
  Bottom 0.254: v146,78.5 145,79.5 145,81 142.5,83.5 v139.5,83.5
N$25
  Top 1.27: X5.2 11.79,24.8 15.88,28.89 15.88,32.38 D1.A
  Bottom 1.27: D1.A 24.45,30.8 Q2.2
N$26
  Top 0.254: JP4.1 125.41,32.07 121.92,35.56 121.92,43.81 121.28,44.45 114.78,44.45 U5.10
N$27
  Top 0.254: JP4.2 125.41,34.61 122.56,37.47 122.56,44.13 121.61,45.08 U5.11
N$28
  Top 0.254: U5.12 121.92,45.73 123.19,44.45 123.19,39.37 125.41,37.15 JP4.3
N$29
  Top 0.254: U5.14 121.57,47.02 123.83,44.77 123.83,41.27 125.41,39.69 JP4.4
N$30
  Top 0.254: JP4.5 125.41,42.23 124.46,43.18 124.46,45.09 121.22,48.33 U5.16
N$31
  Top 0.254: U5.17 121.52,48.98 125.73,44.77 JP4.6
N$32
  Top 0.254: U5.19 121.17,50.27 124.14,47.31 JP4.7
N$33
  Top 0.254: U5.20 121.48,50.92 122.56,49.85 JP4.8
N$34
  Top 0.254: R31.1 LED8.A
N$35  (via drill 0.25)
  Top 0.254: LED8.C v146,81 | U6.14 137.97,83.47 v138.5,84
  Bottom 0.254: v146,81 143,84 v138.5,84
N$36
  Top 0.381: U2.6 44.13,15.24 44.45,15.56 C4.1
N$37  (via drill 0.35)
  Top 0.381: U2.2 v38.73,14.29 L1.1 | C4.2 v48.58,15.56
  Bottom 0.381: v48.58,15.56 47.62,16.51 40.96,16.51 v38.73,14.29
  pour Top: 33.97,14.61 33.97,9.53 37.78,9.53 37.78,13.97 40.96,13.97 40.96,14.61
N$39
  Top 0.381: U2.4 45.34,13.34 | 45.34,13.34 R18.2 | R17.1 46.99,13.02 46.67,13.34 | 45.34,13.34 46.67,13.34 | TP8.TP 46.67,13.34
P4_BTN7  (via drill 0.25)
  Top 0.254: S7.A2 149.25,85.75 v148.5,85 148.45,84.95 R32.2 | U6.16 136.68,84.17 v137,84.5
  Bottom 0.254: v137,84.5 137.5,85 v148.5,85
P5_BTN8  (via drill 0.25)
  Top 0.254: U6.17 v136.03,83 136.03,85.03 v136.5,85.5 | R33.2 v130,83.5 | S8.A2 139.75,85.75 v139.5,85.5
  Bottom 0.254: v130,83.5 135.53,83.5 v136.03,83 | v139.5,85.5 v136.5,85.5
P6_BTN9  (via drill 0.25)
  Top 0.254: U6.19 134.72,92.22 v135,92.5 | v140,92.5 140.25,92.75 S9.A2 143.25,92.75 143.5,92.5 R34.2
  Bottom 0.254: v135,92.5 v140,92.5
P7_BTN10
  Top 0.254: U6.20 134.07,83.92 133.5,84.5 132.72,84.5 S10.A2 129.25,85.75 128.5,86.5 128.5,92.45 R35.2
PCF_INT_0  (via drill 0.25)
  Top 0.254: U5.1 113.67,51.41 113.67,60.33 v113.03,60.96 | v80.64,60.33 80.64,42.55 v80.33,42.23 | R23.1 73.66,41.59 v73.03,42.22 | TP16.TP U1.4
  Bottom 0.254: v113.03,60.96 81.28,60.96 v80.64,60.33 | v80.33,42.23 v80.32,42.22 v73.03,42.22 U1.4
PCF_INT_1  (via drill 0.25)
  Top 0.254: U6.1 133.49,75.56 132.72,75.56 131.44,74.3 v131.44,62.23 | v79.69,60.96 79.69,45.09 v79.38,44.77 | R27.1 73.66,45.4 v73.03,44.76 | TP15.TP U1.3
  Bottom 0.254: v131.44,62.23 130.81,61.59 80.33,61.59 v79.69,60.96 | v79.38,44.77 v79.37,44.76 v73.03,44.76 U1.3
PIEZO_0  (via drill 0.25)
  Top 0.254: LS1.1 121.88,17.5 121.28,18.1 121.28,21.91 v120.65,22.54 | v72.71,23.18 72.07,22.54 72.07,14.92 v71.44,14.29
  Bottom 0.254: v72.71,23.18 120.02,23.18 v120.65,22.54 | U1.15 v71.43,14.28 v71.44,14.29
POTI_0  (via drill 0.25)
  Top 0.254: U4.4 78.5,64 78,64.5 78,67.5 v77.5,68
  Bottom 0.254: R5.2 64,68 v77.5,68
POTI_1  (via drill 0.25)
  Top 0.254: U4.5 78,63.5 77.5,64 77.5,67 76,68.5 v75.5,68.5
  Bottom 0.254: v75.5,68.5 74.5,68.5 74,69 R6.2
POTI_2  (via drill 0.25)
  Top 0.254: U4.6 v86,63.5 | v90,63.5 90.5,64 90.5,68 v90,68.5
  Bottom 0.254: R7.2 87.5,68.5 v90,68.5 | v86,63.5 v90,63.5
POTI_3  (via drill 0.25)
  Top 0.254: U4.7 v85.5,64 | R8.2 98,64.5 v97.5,64
  Bottom 0.254: v85.5,64 v97.5,64
REWIRE_0_0  (via drill 0.25)
  Top 0.254: v55.88,50.8 56.52,50.16 56.52,30.16 v57.15,29.53
  Bottom 0.254: v55.88,50.8 JP2.1 | v57.15,29.53 v57.15,29.52 U1.9
REWIRE_0_1  (via drill 0.25)
  Top 0.254: v56.52,53.34 57.15,52.7 57.15,32.7 v57.78,32.07
  Bottom 0.254: v56.52,53.34 JP2.2 | v57.78,32.07 v57.79,32.06 U1.8
REWIRE_0_2  (via drill 0.25)
  Top 0.254: v57.15,55.88 57.78,55.24 57.78,35.24 v58.42,34.61
  Bottom 0.254: v57.15,55.88 JP2.3 | v58.42,34.61 v58.42,34.6 U1.7
REWIRE_0_3  (via drill 0.25)
  Top 0.254: v57.78,58.42 58.42,57.78 58.42,37.78 v59.05,37.15
  Bottom 0.254: v57.78,58.42 JP2.4 | v59.05,37.15 v59.06,37.14 U1.6
REWIRE_0_4  (via drill 0.25)
  Top 0.254: v58.42,60.96 59.05,60.33 59.05,40.32 v59.69,39.69
  Bottom 0.254: v58.42,60.96 JP2.5 | v59.69,39.69 v59.69,39.68 U1.5
SCL  (via drill 0.25)
  Top 0.254: U4.10 82.5,65.5 82,65 82,61.51 82.55,60.96 v82.55,59.69 v82.55,49.85 82.55,45.09 v82.87,44.77 | U6.2 134.72,75.35 134.3,74.93 133.03,74.93 132.08,73.98 v132.08,60.96 | U5.2 113.24,50.27 113.03,50.48 113.03,59.69 v112.39,60.33 | R21.1 v84.14,50.48 | TP10.TP U1.22
  Bottom 0.254: v82.87,44.77 U1.22 | v82.55,59.69 83.19,60.33 v112.39,60.33 131.44,60.33 v132.08,60.96 | v84.14,50.48 83.19,50.48 v82.55,49.85
SDA  (via drill 0.25)
  Top 0.254: U4.9 83,65 82.5,64.5 82.5,61.96 83.5,60.96 v83.5,59.05 83.5,52.39 | v83.82,37.15 83.5,37.47 83.5,52.39 | U6.4 136.03,75.38 134.94,74.3 133.35,74.3 132.72,73.66 v132.72,60.33 | U5.4 113.27,48.98 112.39,49.85 112.39,59.05 v111.76,59.69 | R22.1 84.14,53.02 83.5,52.39 | TP11.TP U1.25
  Bottom 0.254: v83.82,37.15 U1.25 | v83.5,59.05 84.14,59.69 v111.76,59.69 132.08,59.69 v132.72,60.33
SEG_A  (via drill 0.25)
  Top 0.254: U3.14 51.75,92.39 v52.39,93.03
  Bottom 0.254: DS1.14 73.03,93.03 v52.39,93.03
SEG_B  (via drill 0.25)
  Top 0.254: U3.16 49.21,93.66 v49.85,94.3
  Bottom 0.254: DS1.16 69.22,94.3 v49.85,94.3
SEG_C  (via drill 0.25)
  Top 0.254: U3.20 44.13,97.47 v44.77,98.11
  Bottom 0.254: DS1.13 76.83,98.11 v44.77,98.11
SEG_D  (via drill 0.25)
  Top 0.254: U3.23 40.32,86.36 v40.96,85.72
  Bottom 0.254: DS1.3 75.25,87 70.17,87 68.9,85.72 v40.96,85.72
SEG_DP  (via drill 0.25)
  Top 0.254: U3.22 41.59,87.63 v42.23,87
  Bottom 0.254: DS1.7 84.14,88.27 69.53,88.27 68.26,87 v42.23,87
SEG_E  (via drill 0.25)
  Top 0.254: U3.21 42.86,87 v43.5,86.36
  Bottom 0.254: DS1.5 79.69,87.63 69.85,87.63 68.58,86.36 v43.5,86.36
SEG_F  (via drill 0.25)
  Top 0.254: U3.15 50.48,91.76 v51.12,92.39
  Bottom 0.254: DS1.11 80.01,92.39 v51.12,92.39
SEG_G  (via drill 0.25)
  Top 0.254: U3.17 47.94,93.03 v48.58,93.66
  Bottom 0.254: DS1.15 71.12,93.66 v48.58,93.66
SPI_CLK  (via drill 0.25)
  Top 0.254: v14.61,50.16 15.24,49.53 15.24,44.77 v15.88,44.13 | U3.13 53.02,88.58 53.66,87.95 53.66,63.5 v54.29,62.87 | v60.33,62.87 59.69,62.23 v59.69,44.77 | v79.06,29.53 78.74,29.84 v78.74,62.23 | TP9.TP U1.28
  Bottom 0.254: X4.2 v14.61,50.16 | v54.29,62.87 v60.33,62.87 78.11,62.87 v78.74,62.23 | v59.69,44.77 59.05,44.13 v15.88,44.13 | v79.06,29.53 U1.28
SPI_MOSI  (via drill 0.25)
  Top 0.254: U3.1 39.05,78.74 v39.69,78.11 | v51.75,78.11 52.39,77.47 52.39,62.23 v53.02,61.59 | v60.96,61.59 60.33,60.96 v60.33,44.13 | v77.15,47.31 76.83,47.62 v76.83,60.96 | TP12.TP U1.21
  Bottom 0.254: v39.69,78.11 v51.75,78.11 | v53.02,61.59 v60.96,61.59 76.2,61.59 v76.83,60.96 | X4.3 13.89,45.16 15.56,43.5 59.69,43.5 v60.33,44.13 | v77.15,47.31 U1.21

### Text on the board
tNames: The Technical / Faculty was / founded in ... ? | GND | LASER / SENSE | +3V3 | +5V | LED / RING | GND | 0x58+0x42=0b........? | SPI / CLK | SPI / MOSI | +5V | GND | +12V | Drain | +12V | GND